# EAGLE design version_2 (EAGLE 6.1)

## Sheet 1 of 6
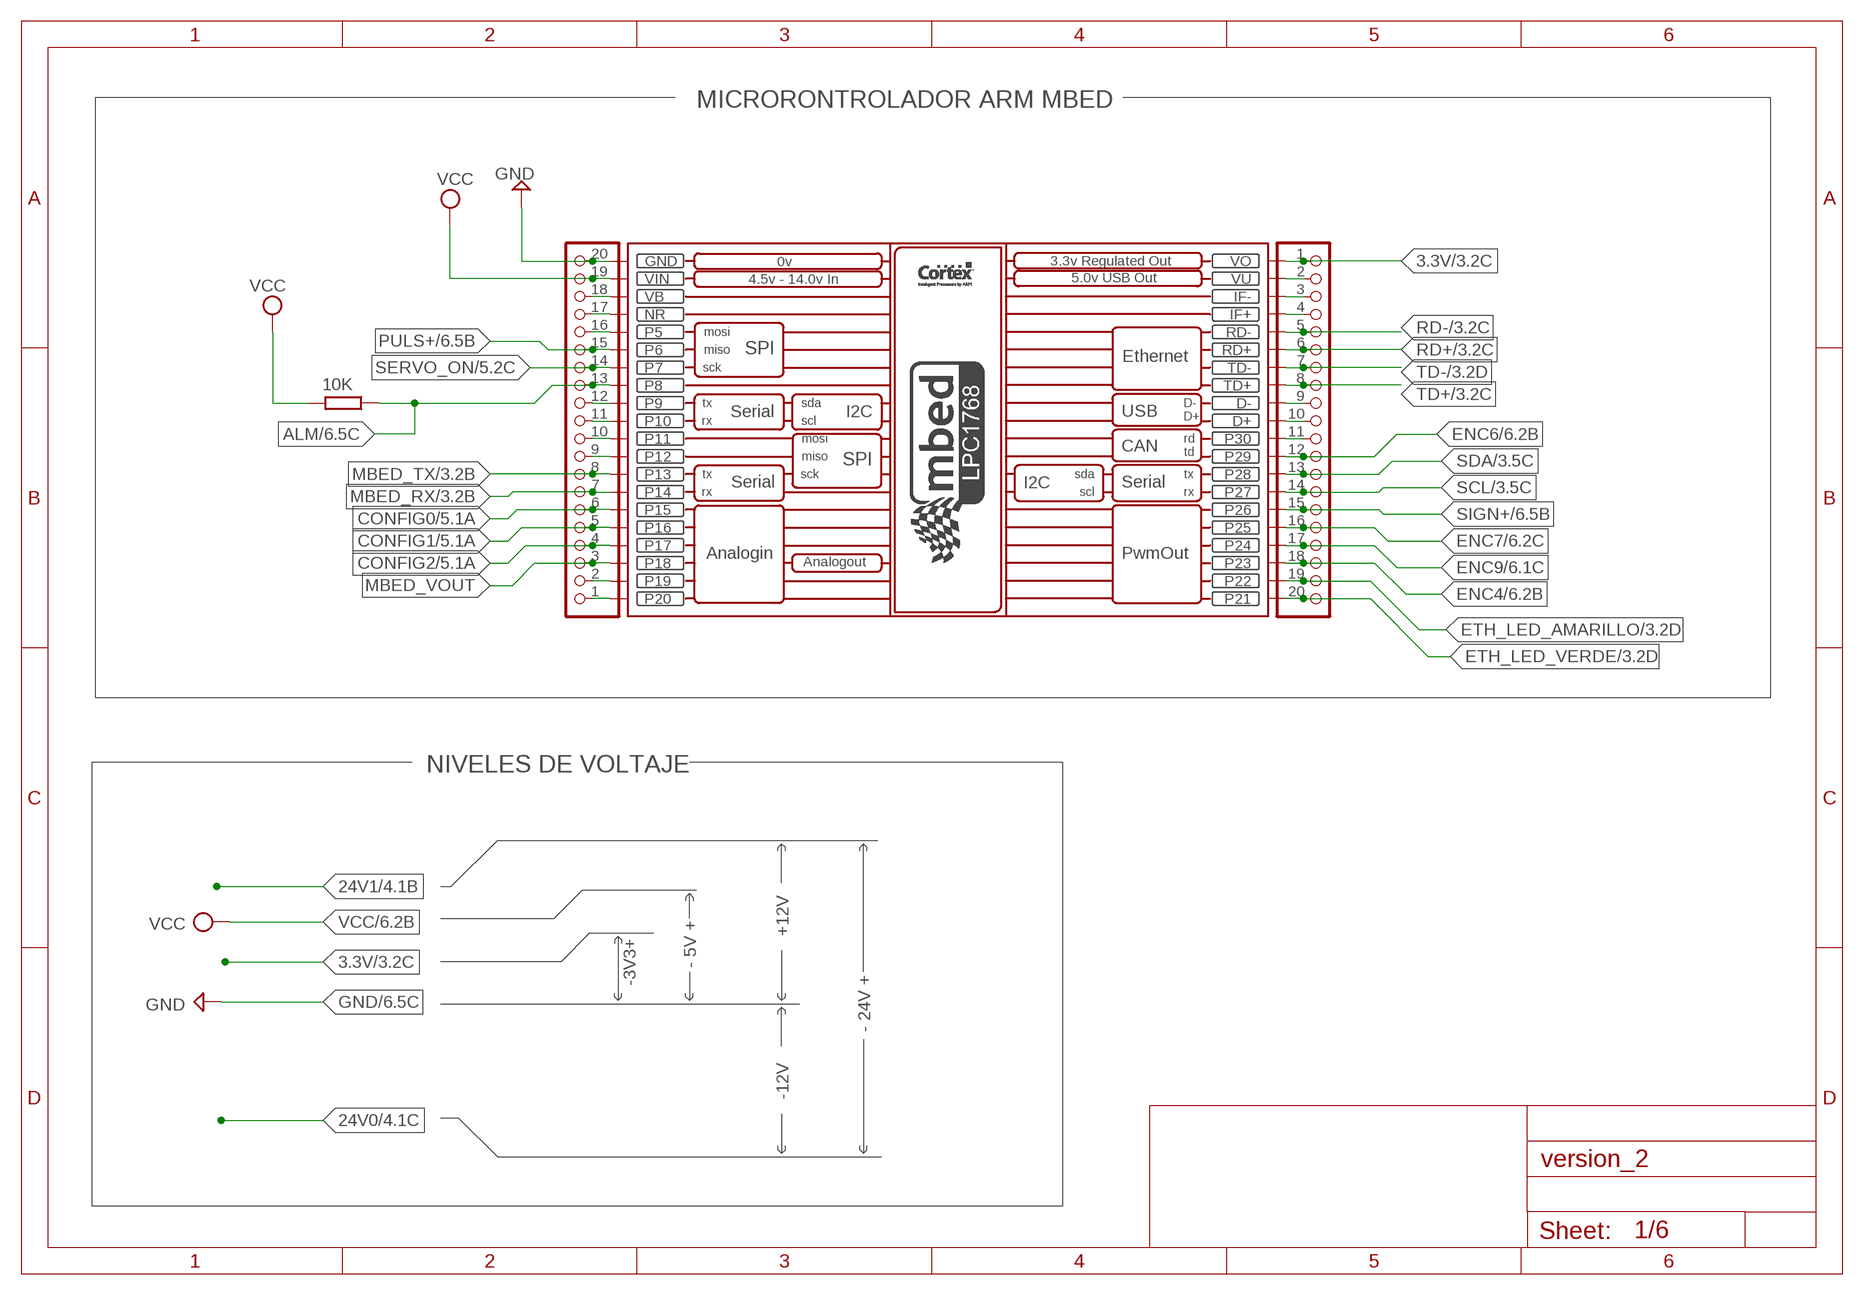
[diagram p0: schematic, sheet 1]

### Parts
JP_LEFT  PINHD-1X20  [1X20]
JP_RIGHT  PINHD-1X20  [1X20]
KIT1  MBED_NXP_LPC1768  [MBED-KIT]
R16_ALM  10K  R-EU_0207/12  [0207/12]

### Nets
3.3V: JP_RIGHT.1 KIT1.VOUT(VO) ; also sheet 3
ALM: JP_LEFT.13 KIT1.P$8(P8) R16_ALM.1 ; also sheet 6
CONFIG0: JP_LEFT.6 KIT1.P$15(P15) ; also sheet 5
CONFIG1: JP_LEFT.5 KIT1.P$16(P16) ; also sheet 5
CONFIG2: JP_LEFT.4 KIT1.P$17(P17) ; also sheet 5
ENC4: JP_RIGHT.18 KIT1.P$23(P23) ; also sheet 6
ENC6: JP_RIGHT.12 KIT1.P$29(P29) ; also sheet 6
ENC7: JP_RIGHT.16 KIT1.P$25(P25) ; also sheet 6
ENC9: JP_RIGHT.17 KIT1.P$24(P24) ; also sheet 6
ETH_LED_AMARILLO: JP_RIGHT.19 KIT1.P$22(P22) ; also sheet 3
ETH_LED_VERDE: JP_RIGHT.20 KIT1.P$21(P21) ; also sheet 3
GND: JP_LEFT.20 KIT1.GND ; also sheet 2,3,4,5,6
MBED_RX: JP_LEFT.7 KIT1.P$14(P14) ; also sheet 3
MBED_TX: JP_LEFT.8 KIT1.P$13(P13) ; also sheet 3
MBED_VOUT: JP_LEFT.3 KIT1.P$18(P18) ; also sheet 4
N$4: JP_LEFT.12 KIT1.P$9(P9)
N$5: JP_RIGHT.2 KIT1.VU
N$6: JP_LEFT.11 KIT1.P$10(P10)
N$7: JP_RIGHT.3 KIT1.IF-
N$14: JP_RIGHT.4 KIT1.IF+
N$16: JP_RIGHT.11 KIT1.P$30(P30)
N$31: JP_RIGHT.9 KIT1.D-
N$32: JP_RIGHT.10 KIT1.D+
N$48: JP_LEFT.18 KIT1.VB
N$49: JP_LEFT.17 KIT1.NR
N$50: JP_LEFT.16 KIT1.P$5(P5)
N$53: JP_LEFT.10 KIT1.P$11(P11)
N$54: JP_LEFT.9 KIT1.P$12(P12)
N$59: JP_LEFT.2 KIT1.P$19(P19)
N$60: JP_LEFT.1 KIT1.P$20(P20)
PULS+: JP_LEFT.15 KIT1.P$6(P6) ; also sheet 6
RD+: JP_RIGHT.6 KIT1.RD+ ; also sheet 3,6
RD-: JP_RIGHT.5 KIT1.RD- ; also sheet 3,6
SCL: JP_RIGHT.14 KIT1.P$27(P27) ; also sheet 3,6
SDA: JP_RIGHT.13 KIT1.P$28(P28) ; also sheet 3,6
SERVO_ON: JP_LEFT.14 KIT1.P$7(P7) ; also sheet 5
SIGN+: JP_RIGHT.15 KIT1.P$26(P26) ; also sheet 6
TD+: JP_RIGHT.8 KIT1.TD+ ; also sheet 3,6
TD-: JP_RIGHT.7 KIT1.TD- ; also sheet 3,6
VCC: JP_LEFT.19 KIT1.VIN R16_ALM.2 ; also sheet 2,3,5,6

### Notes on the sheet
- MICRORONTROLADOR ARM MBED
- NIVELES DE VOLTAJE
- +12V
- - 5V +
- -3V3+
- - 24V +
- -12V

## Sheet 2 of 6
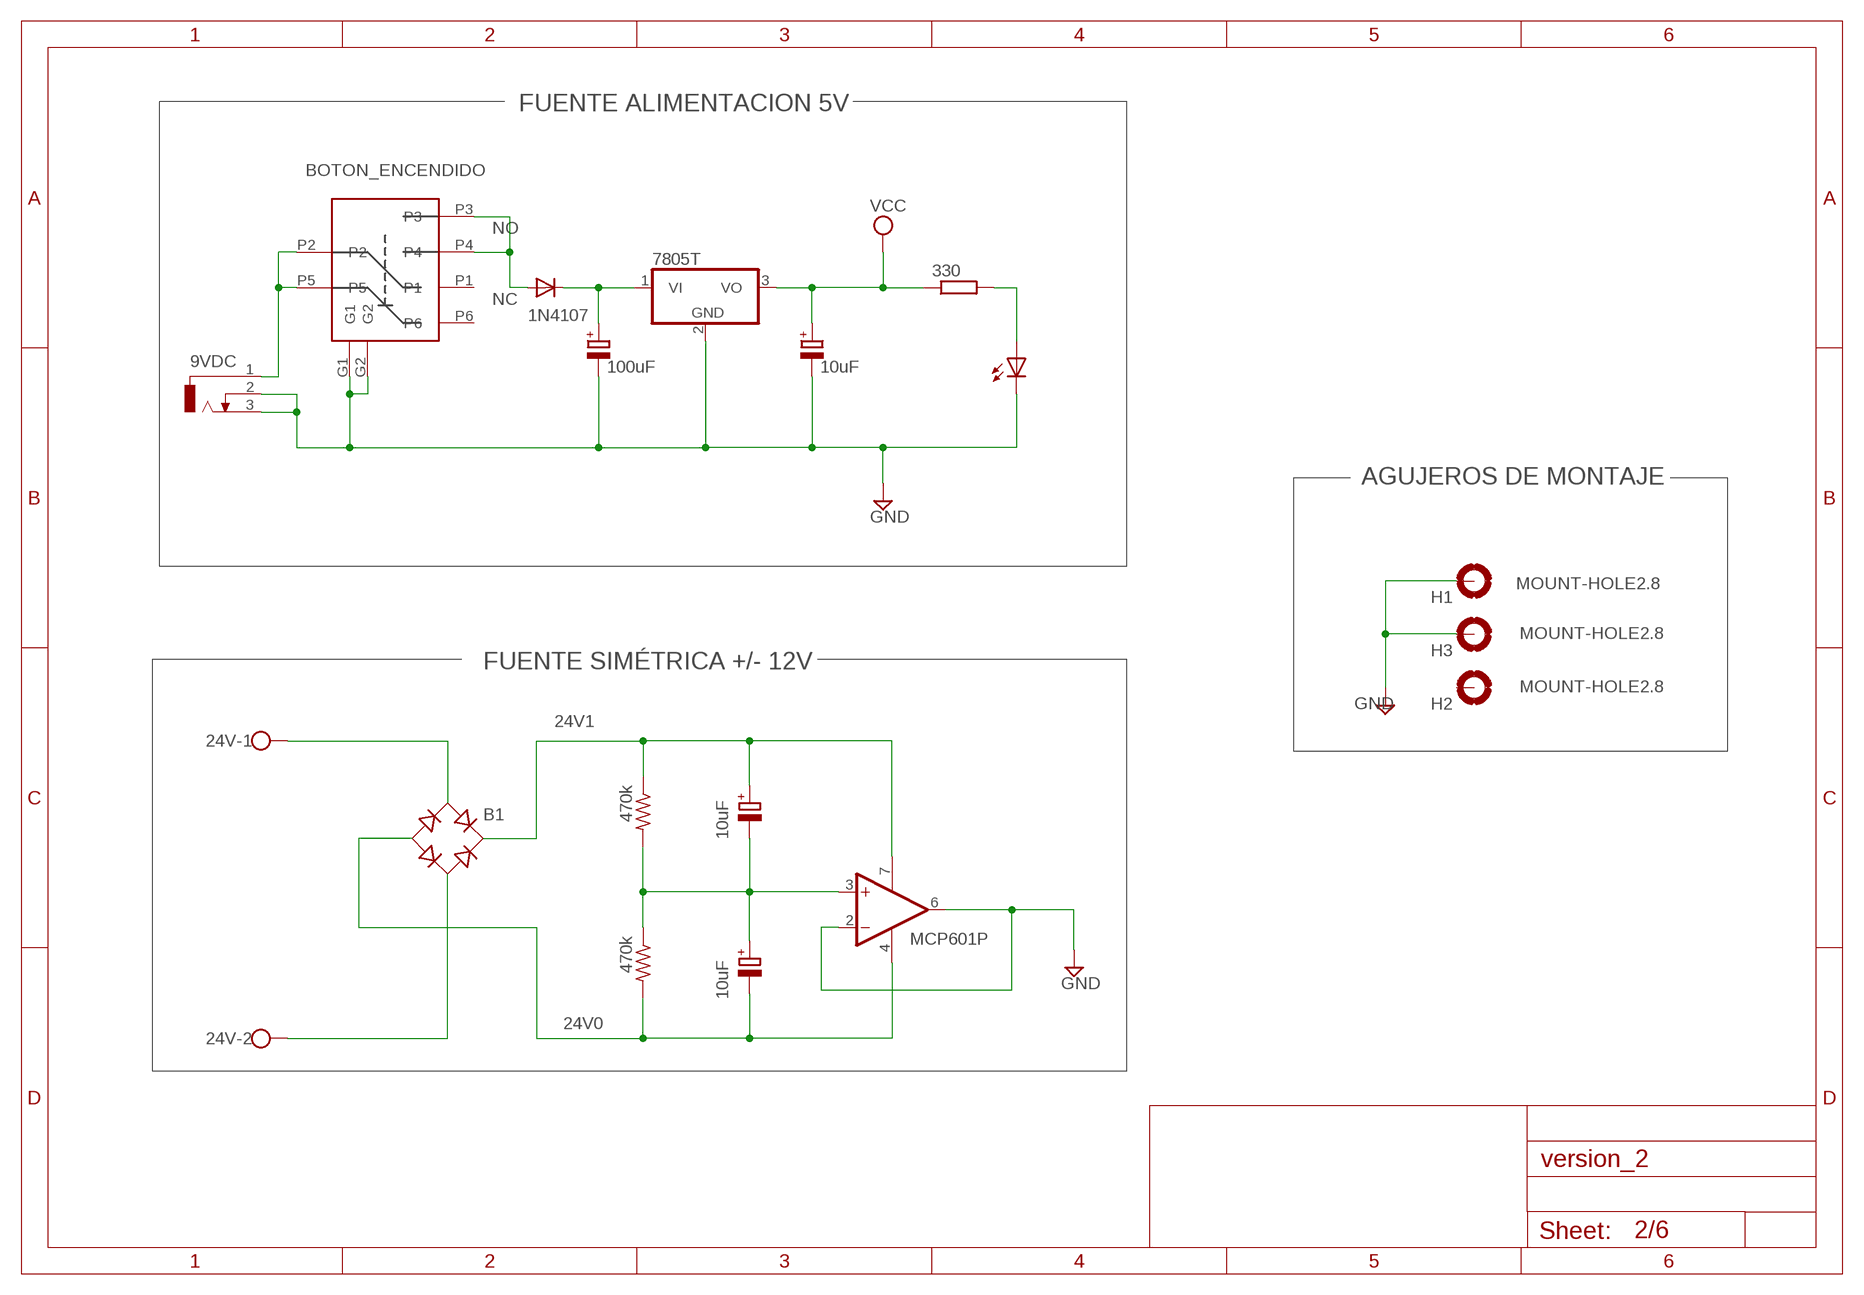
[diagram p1: schematic, sheet 2]

### Parts
9VDC  DCJ0303  [DCJ0303]
24V  W237-02P  [W237-132]
B1  RB1A  [RB1A]
C1_9V  100uF  CPOL-EUTT5D7  [TT5D7]
C1_+24  10uF  CPOL-EUTT5D7  [TT5D7]
C2_0V  10uF  CPOL-EUTT5D7  [TT5D7]
C2_9V  10uF  CPOL-EUTT5D7  [TT5D7]
D1_INPUT  1N4107  1N4148DO35-10  [DO35-10]
H1  MOUNT-HOLE2.8  MOUNT-PAD-ROUND3.3  [3,3-PAD]
H2  MOUNT-HOLE2.8  MOUNT-PAD-ROUND3.3  [3,3-PAD]
H3  MOUNT-HOLE2.8  MOUNT-PAD-ROUND3.3  [3,3-PAD]
IC2  7805T  [TO220H]
IC3  MCP601P  [DIL08]
ON/OFF  BOTON_ENCENDIDO  [BOTON_ENCNEDIDO]
POWER  LED3MM  [LED3MM]
PWR_LED_R  330  R-EU_0204/7  [0204/7]
R1_DIV  470k  R-US_0207/10  [0207/10]
R2_DIV  470k  R-US_0207/10  [0207/10]

### Nets
24V0: B1.- C2_0V.- IC3.4(V-) R2_DIV.2 ; also sheet 1,4,5,6
24V1: B1.+ C1_+24.+ IC3.7(V+) R1_DIV.1 ; also sheet 1,4,6
GND: 9VDC.2 9VDC.3 C1_9V.- C2_9V.- H1.B3,3(MOUNT) H3.B3,3(MOUNT) IC2.2(GND) IC3.2(-IN) IC3.6(OUT) ON/OFF.G1 ON/OFF.G2 POWER.K(C) ; also sheet 1,3,4,5,6
N$1: 24V.1 B1.AC1
N$2: 24V.2 B1.AC2
N$3: C1_+24.- C2_0V.+ IC3.3(+IN) R1_DIV.2 R2_DIV.1
N$12: D1_INPUT.A ON/OFF.P3 ON/OFF.P4
N$18: 9VDC.1 ON/OFF.P2 ON/OFF.P5
N$21: C1_9V.+ D1_INPUT.C IC2.1(VI)
N$61: POWER.A PWR_LED_R.2
VCC: C2_9V.+ IC2.3(VO) PWR_LED_R.1 ; also sheet 1,3,5,6
Unconnected: H2.B3,3(MOUNT) ON/OFF.P1 ON/OFF.P6

### Notes on the sheet
- FUENTE ALIMENTACION 5V
- AGUJEROS DE MONTAJE
- FUENTE SIMÉTRICA +/- 12V

## Sheet 3 of 6
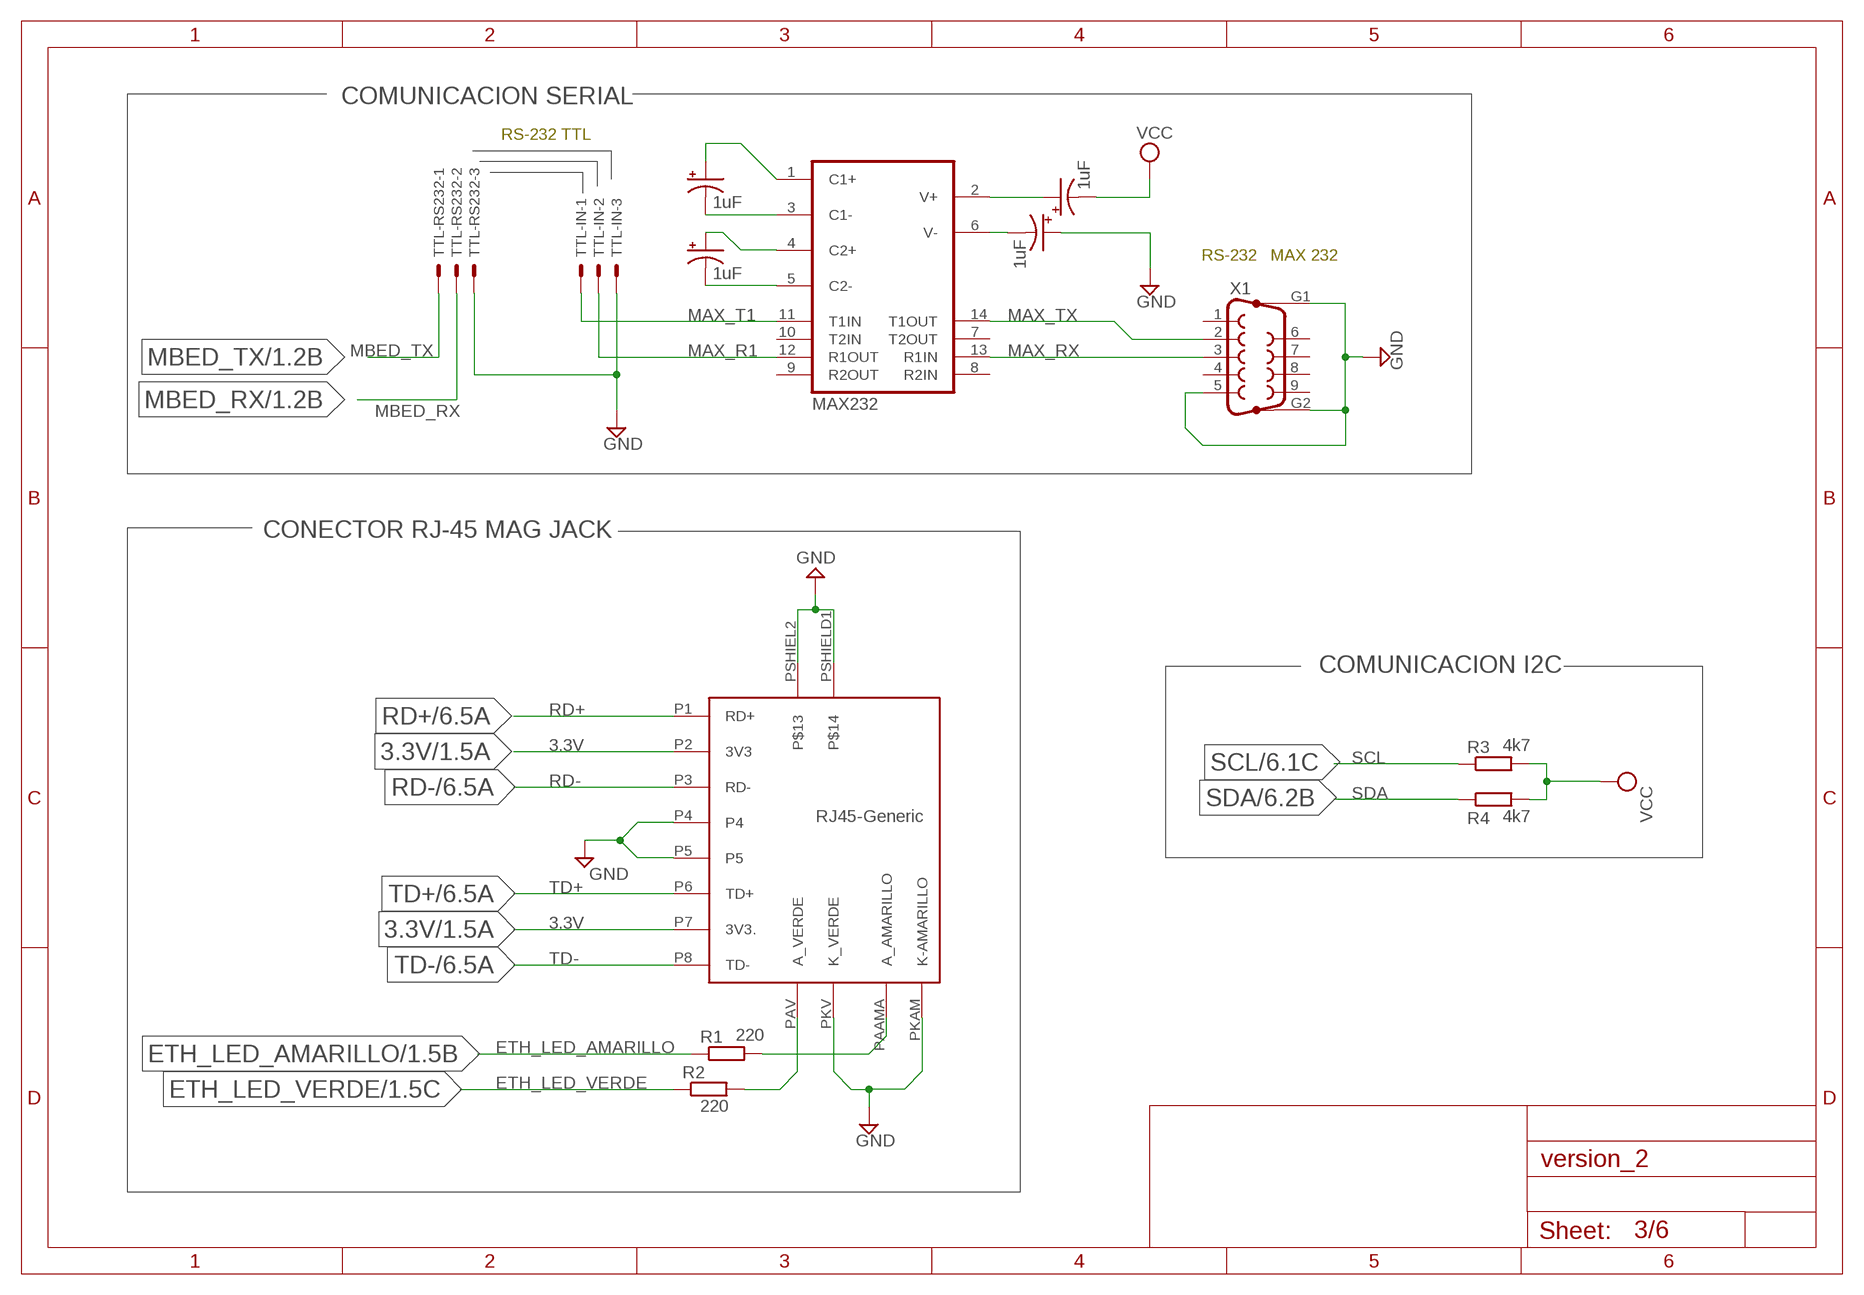
[diagram p2: schematic, sheet 3]

### Parts
C1_MAX  1uF  CPOL-USE2,5-6E  [E2,5-6E]
C2_MAX  1uF  CPOL-USE2,5-6E  [E2,5-6E]
C3_MAX  1uF  CPOL-USE2,5-6E  [E2,5-6E]
C4_MAX  1uF  CPOL-USE2,5-6E  [E2,5-6E]
IC1  MAX232  [DIL16]
R1  220  R-EU_0207/15  [0207/15]
R2  220  R-EU_0207/15  [0207/15]
R3  4k7  R-EU_0204/7  [0204/7]
R4  4k7  R-EU_0204/7  [0204/7]
TTL-IN  22-23-2031  [22-23-2031]
TTL-RS232  22-23-2031  [22-23-2031]
U$1  RJ-45-GENERIC  [RJ45-GENERIC]
X1  F09HP  [F09HP]

### Nets
3.3V: U$1.P2(3V3) U$1.P7(3V3.) ; also sheet 1
ETH_LED_AMARILLO: R1.1 ; also sheet 1
ETH_LED_VERDE: R2.1 ; also sheet 1
GND: C3_MAX.+ TTL-IN.3 TTL-RS232.3 U$1.P4 U$1.P5 U$1.PKAM(K-AMARILLO) U$1.PKV(K_VERDE) U$1.PSHIEL2 U$1.PSHIELD1 X1.5 X1.G1 X1.G2 ; also sheet 1,2,4,5,6
MAX_R1: IC1.12(R1OUT) TTL-IN.2
MAX_RX: IC1.13(R1IN) X1.3 ; also sheet 6
MAX_T1: IC1.11(T1IN) TTL-IN.1
MAX_TX: IC1.14(T1OUT) X1.2 ; also sheet 6
MBED_RX: TTL-RS232.2 ; also sheet 1
MBED_TX: TTL-RS232.1 ; also sheet 1
N$33: C1_MAX.+ IC1.1(C1+)
N$34: C1_MAX.- IC1.3(C1-)
N$35: C2_MAX.- IC1.5(C2-)
N$36: C2_MAX.+ IC1.4(C2+)
N$37: C4_MAX.+ IC1.2(V+)
N$38: C3_MAX.- IC1.6(V-)
N$46: R1.2 U$1.PAAMA(A_AMARILLO)
N$52: R2.2 U$1.PAV(A_VERDE)
RD+: U$1.P1(RD+) ; also sheet 1,6
RD-: U$1.P3(RD-) ; also sheet 1,6
SCL: R3.1 ; also sheet 1,6
SDA: R4.1 ; also sheet 1,6
TD+: U$1.P6(TD+) ; also sheet 1,6
TD-: U$1.P8(TD-) ; also sheet 1,6
VCC: C4_MAX.- R3.2 R4.2 ; also sheet 1,2,5,6
Unconnected: IC1.7(T2OUT) IC1.8(R2IN) IC1.9(R2OUT) IC1.10(T2IN) X1.1 X1.4 X1.6 X1.7 X1.8 X1.9

### Notes on the sheet
- COMUNICACION SERIAL
- RS-232 TTL
- RS-232   MAX 232
- CONECTOR RJ-45 MAG JACK
- COMUNICACION I2C

## Sheet 4 of 6
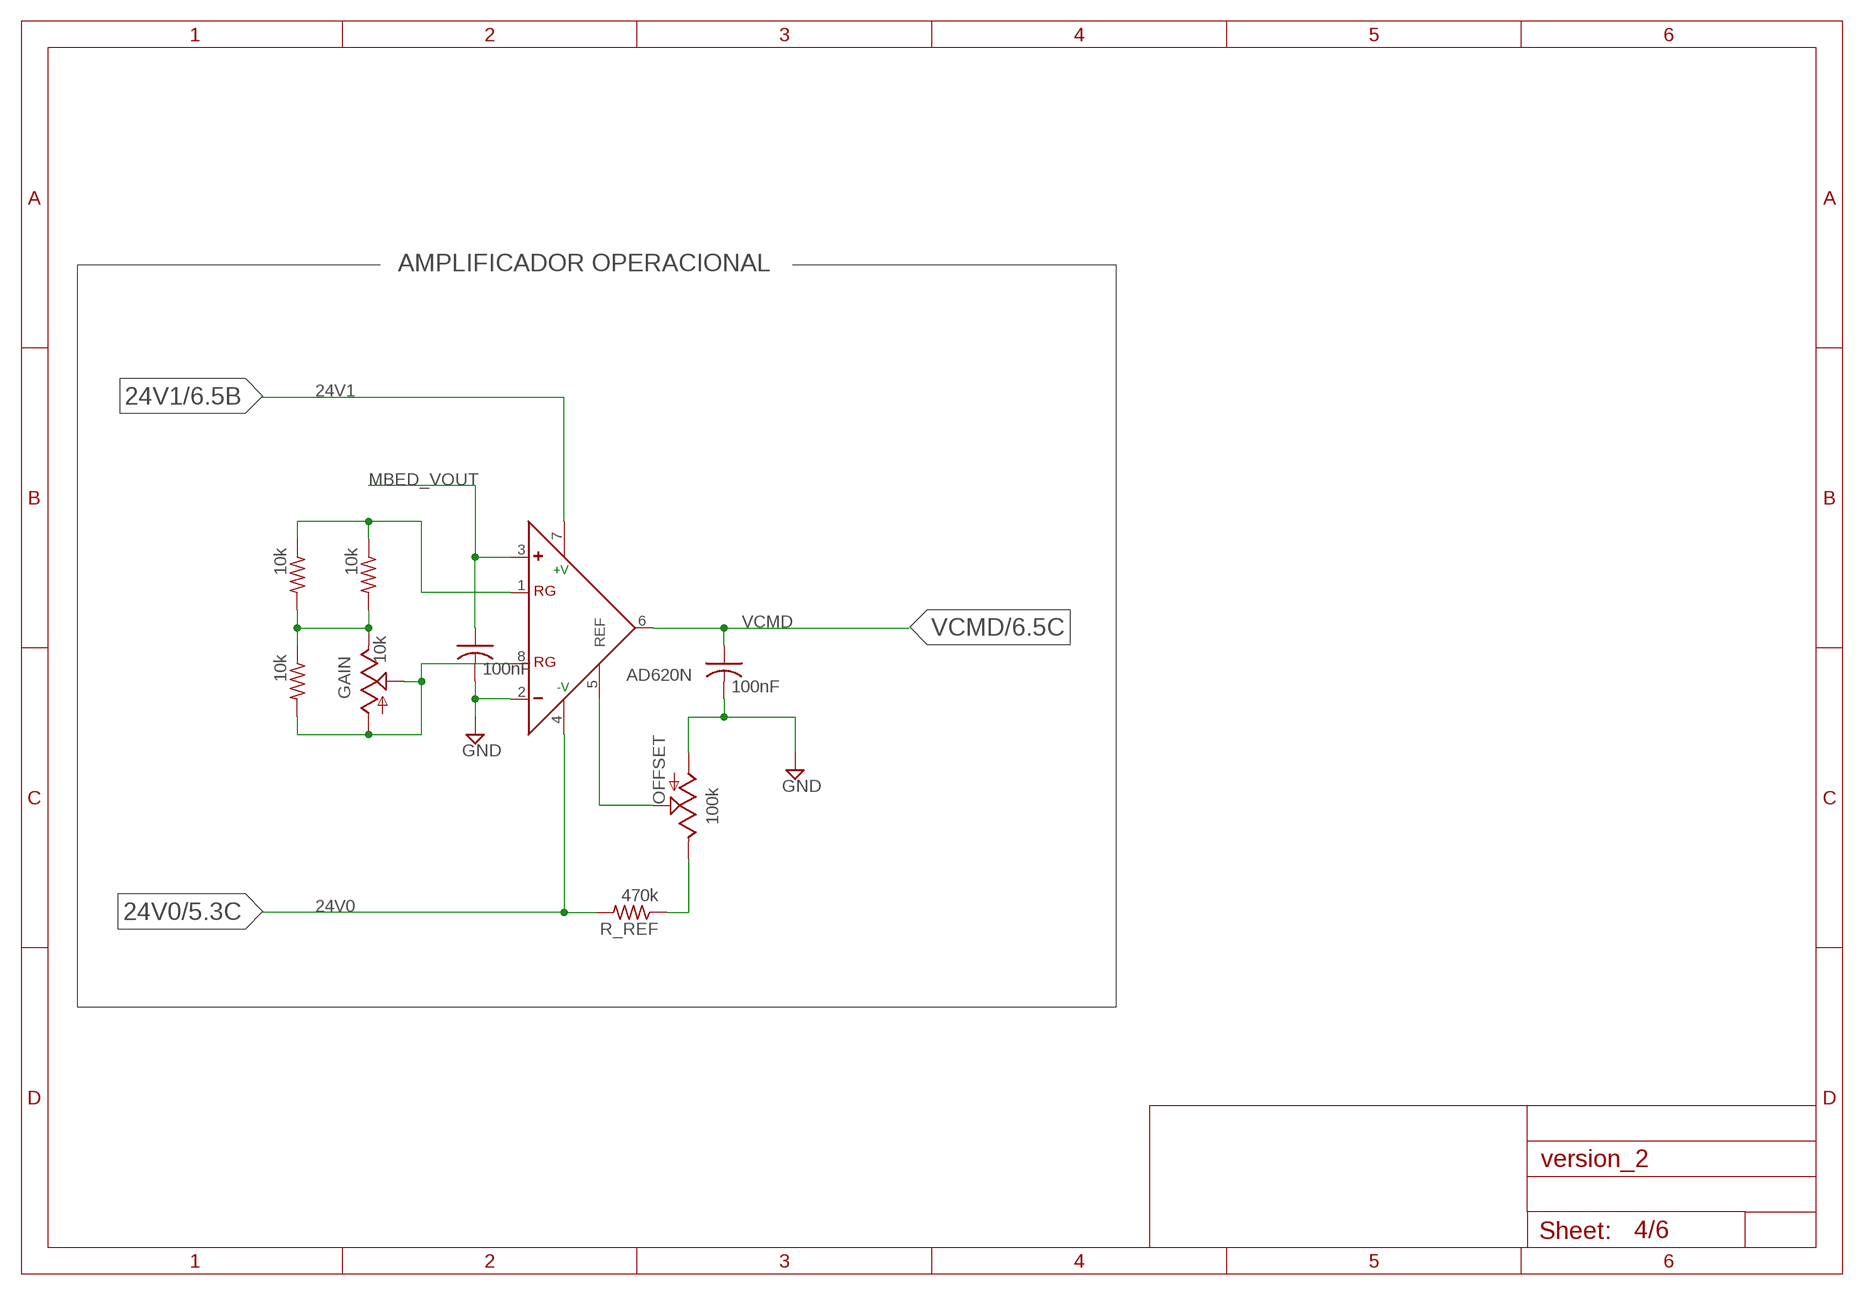
[diagram p3: schematic, sheet 4]

### Parts
C3_AOUT  100nF  C-US025-024X044  [C025-024X044]
C5_AOUT  100nF  C-US025-024X044  [C025-024X044]
GAIN  10k  TRIM_US-RJ9W  [RJ9W]
IC4  AD620N  [DIL08]
OFFSET  100k  TRIM_US-RJ9W  [RJ9W]
R1_G  10k  R-US_0204/7  [0204/7]
R2_G  10k  R-US_0204/7  [0204/7]
R3_G  10k  R-US_0204/7  [0204/7]
R_REF  470k  R-US_0204/7  [0204/7]

### Nets
24V0: IC4.4(-V) R_REF.2 ; also sheet 1,2,5,6
24V1: IC4.7(+V) ; also sheet 1,2,6
GND: C3_AOUT.2 C5_AOUT.2 IC4.2(-) OFFSET.A ; also sheet 1,2,3,5,6
MBED_VOUT: C5_AOUT.1 IC4.3(+) ; also sheet 1
N$8: OFFSET.E R_REF.1
N$9: IC4.1(RG) R1_G.1 R3_G.1
N$10: GAIN.E R1_G.2 R2_G.1 R3_G.2
N$11: GAIN.A GAIN.S IC4.8(RG) R2_G.2
N$15: IC4.5(REF) OFFSET.S
VCMD: C3_AOUT.1 IC4.6(OUT) ; also sheet 6

### Notes on the sheet
- AMPLIFICADOR OPERACIONAL

## Sheet 5 of 6
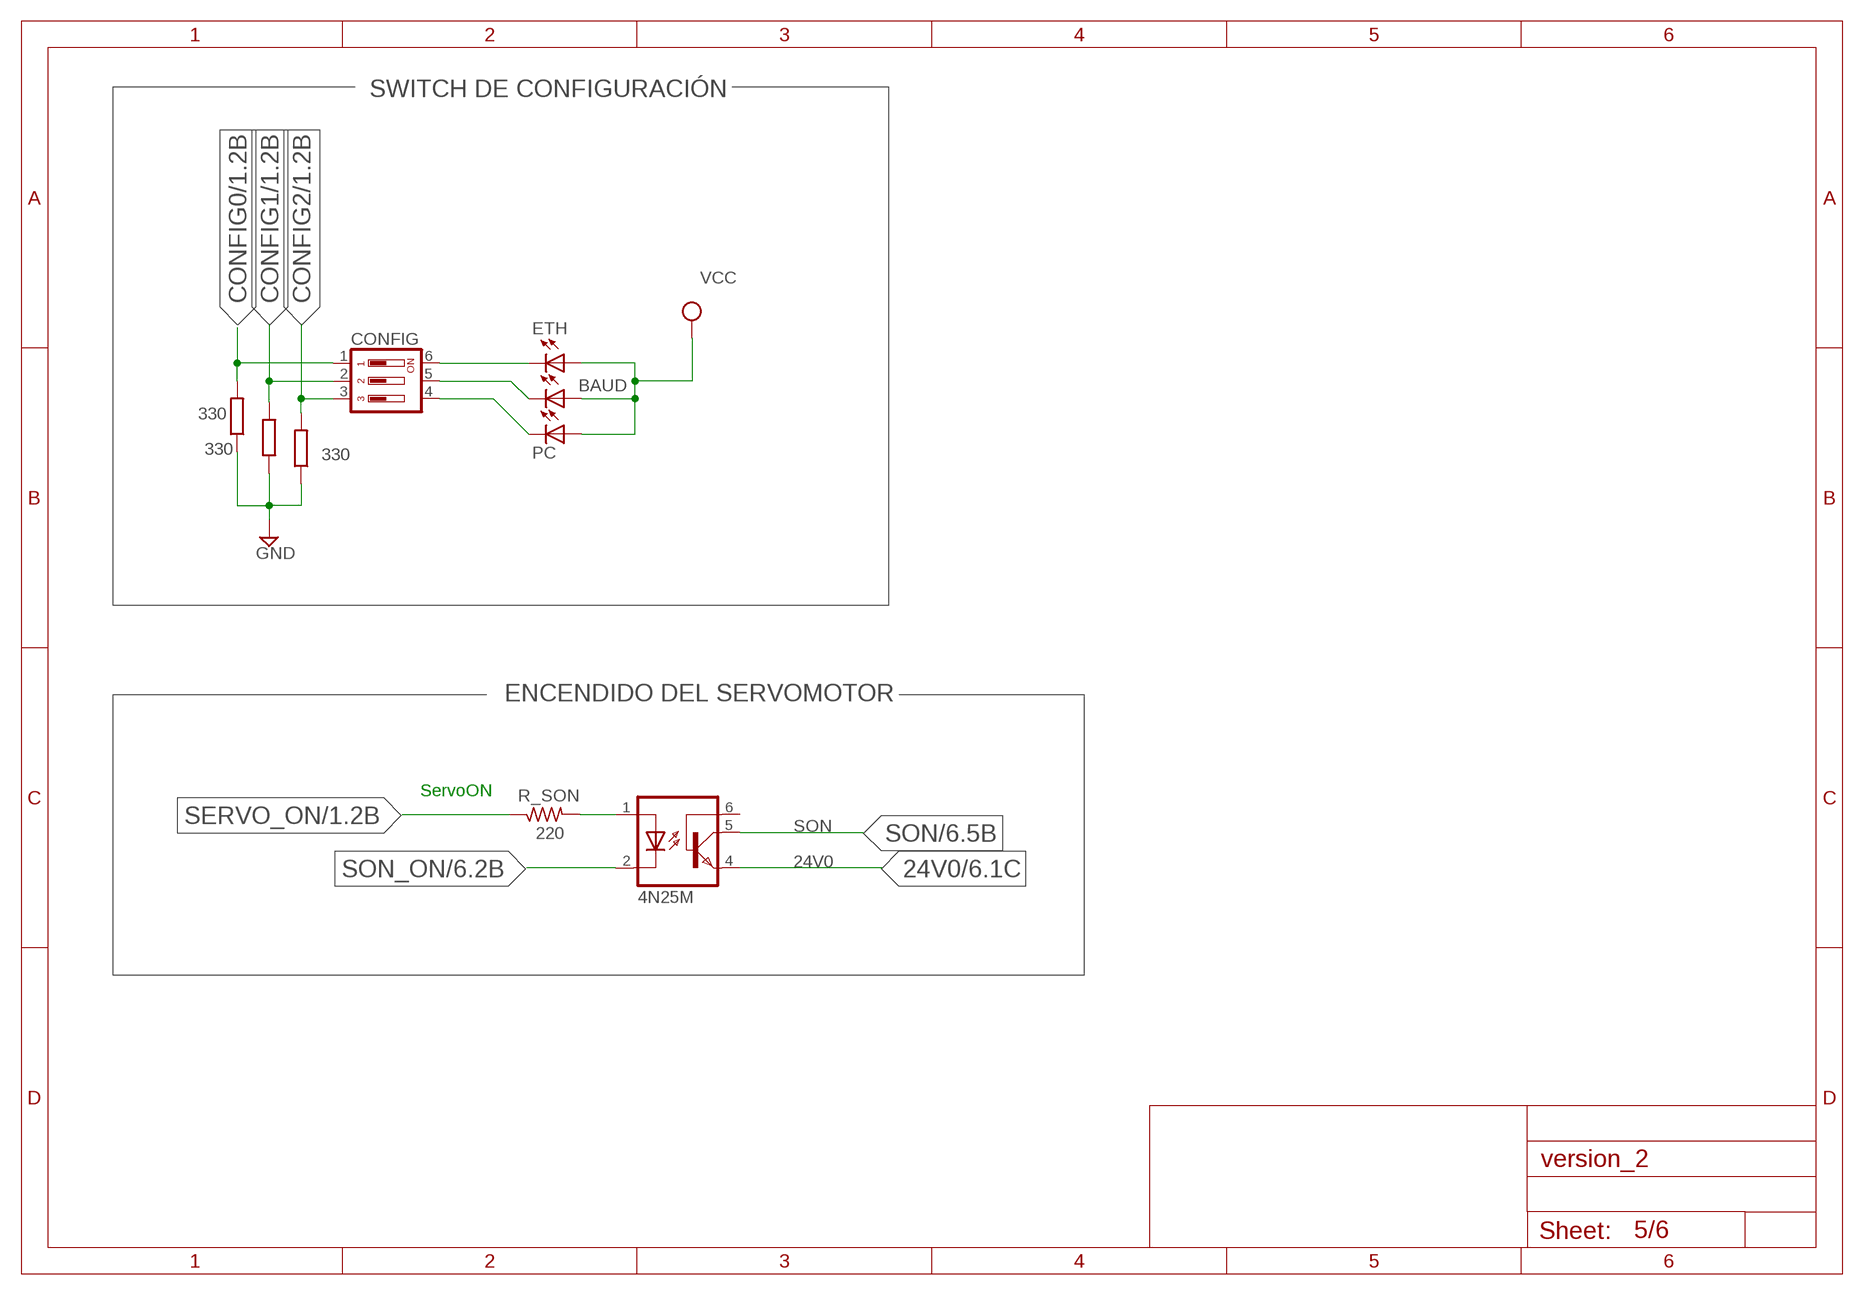
[diagram p4: schematic, sheet 5]

### Parts
BAUD  LED3MM  [LED3MM]
CONFIG  DIP03YL  [DIP03YL]
ETH  LED3MM  [LED3MM]
OK1  4N25M  [DIL06]
PC  LED3MM  [LED3MM]
R13  330  R-EU_0204/7  [0204/7]
R14  330  R-EU_0204/7  [0204/7]
R15  330  R-EU_0204/7  [0204/7]
R_SON  220  R-US_0207/7  [0207/7]

### Nets
24V0: OK1.4(EMI) ; also sheet 1,2,4,6
CONFIG0: CONFIG.1 R15.2 ; also sheet 1
CONFIG1: CONFIG.2 R14.2 ; also sheet 1
CONFIG2: CONFIG.3 R13.2 ; also sheet 1
GND: R13.1 R14.1 R15.1 ; also sheet 1,2,3,4,6
N$20: OK1.1(A) R_SON.2
N$24: CONFIG.6 ETH.K(C)
N$25: BAUD.K(C) CONFIG.5
N$26: CONFIG.4 PC.K(C)
SERVO_ON: R_SON.1 ; also sheet 1
SON: OK1.5(COL) ; also sheet 6
SON_ON: OK1.2(C) ; also sheet 6
VCC: BAUD.A ETH.A PC.A ; also sheet 1,2,3,6
Unconnected: OK1.6(BAS)

### Notes on the sheet
- SWITCH DE CONFIGURACIÓN
- ENCENDIDO DEL SERVOMOTOR
- ServoON

## Sheet 6 of 6
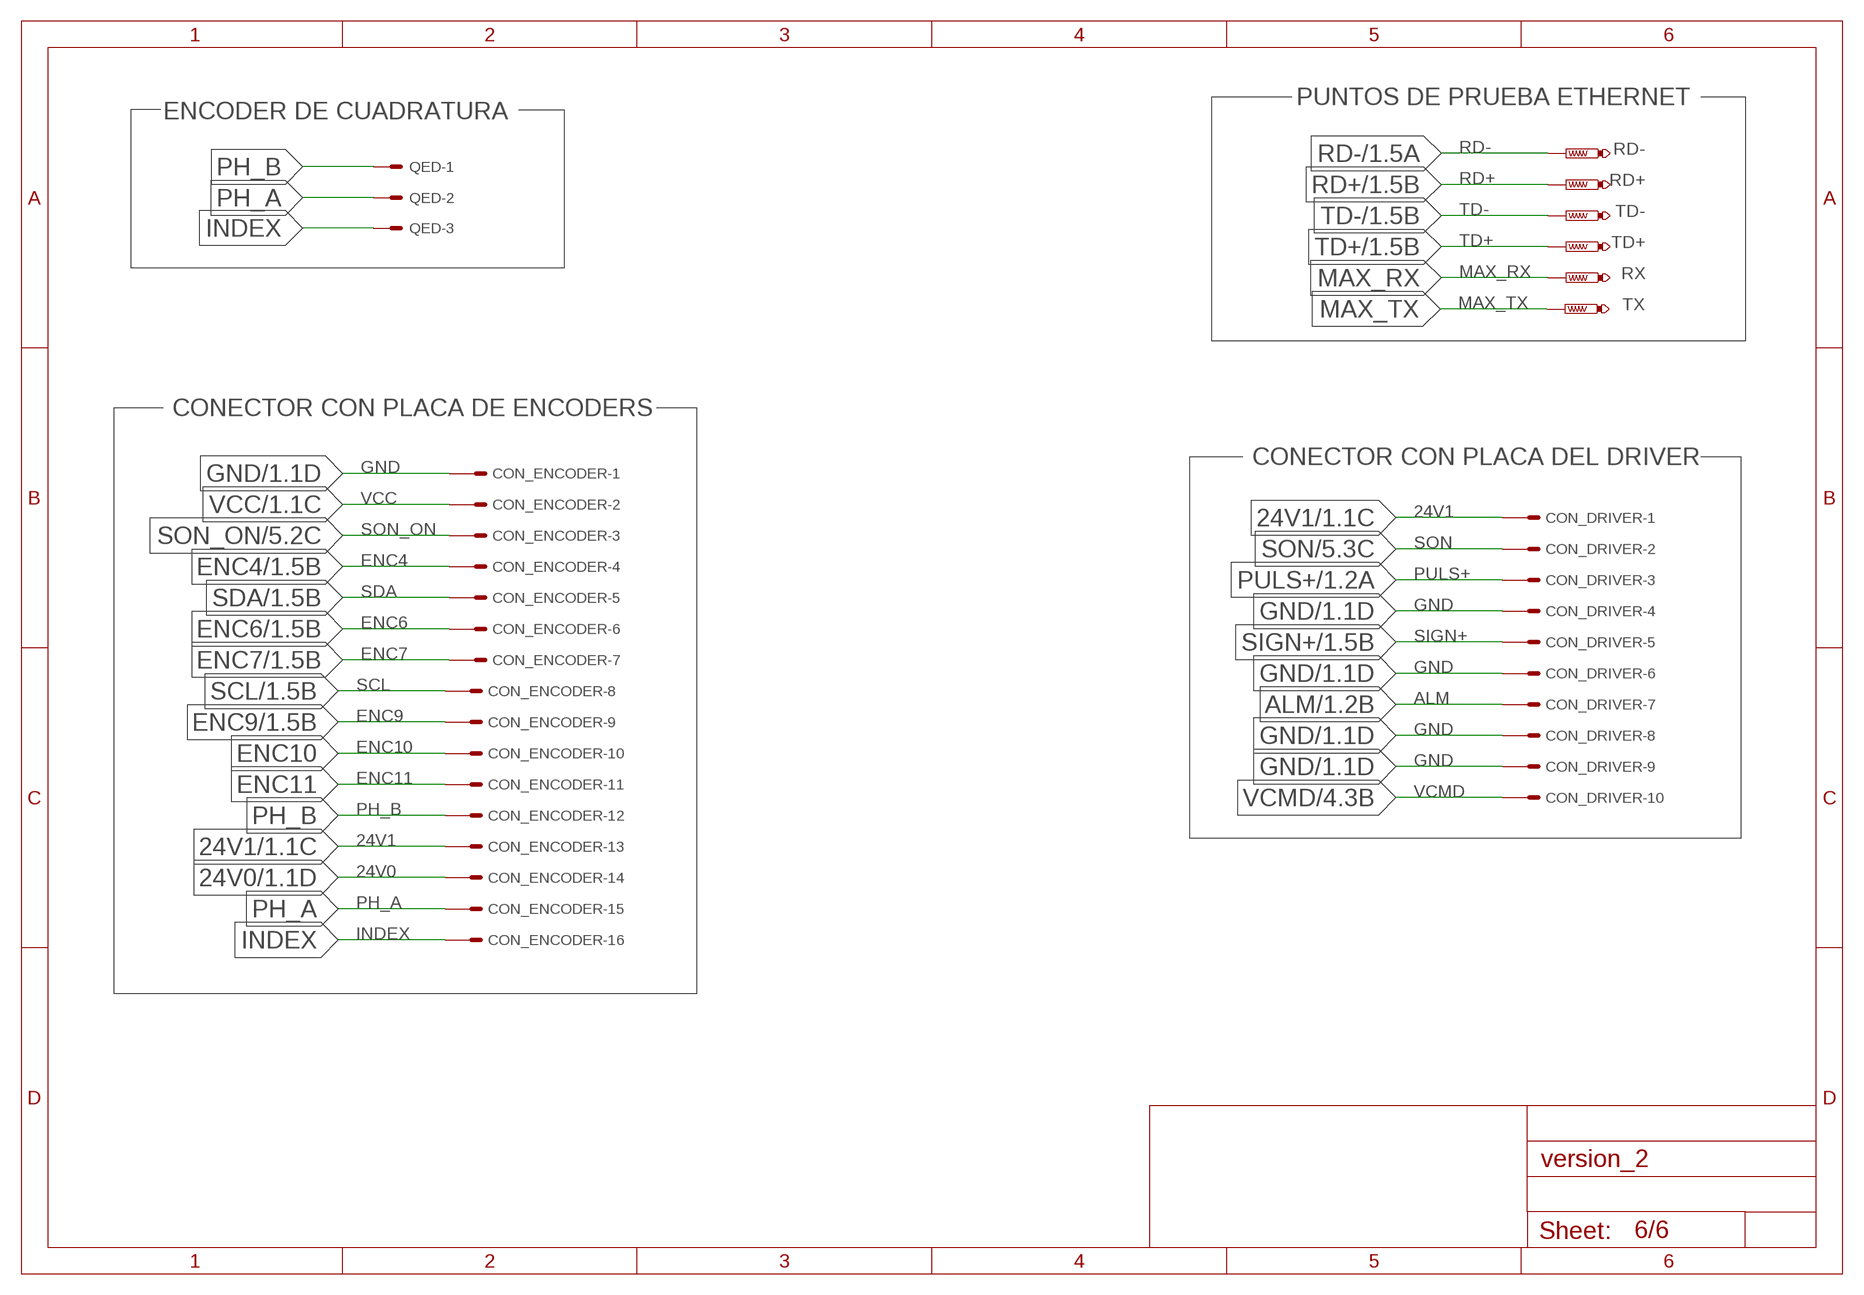
[diagram p5: schematic, sheet 6]

### Parts
CON_DRIVER  057-010-1  [057-010-1]
CON_ENCODER  057-016-1  [057-016-1]
QED  22-23-2031  [22-23-2031]
RD+  PTR1PAD1-13Y  [P1-13Y]
RD-  PTR1PAD1-13Y  [P1-13Y]
RX  PTR1PAD1-13Y  [P1-13Y]
TD+  PTR1PAD1-13Y  [P1-13Y]
TD-  PTR1PAD1-13Y  [P1-13Y]
TX  PTR1PAD1-13Y  [P1-13Y]

### Nets
24V0: CON_ENCODER.14 ; also sheet 1,2,4,5
24V1: CON_DRIVER.1 CON_ENCODER.13 ; also sheet 1,2,4
ALM: CON_DRIVER.7 ; also sheet 1
ENC4: CON_ENCODER.4 ; also sheet 1
ENC6: CON_ENCODER.6 ; also sheet 1
ENC7: CON_ENCODER.7 ; also sheet 1
ENC9: CON_ENCODER.9 ; also sheet 1
ENC10: CON_ENCODER.10
ENC11: CON_ENCODER.11
GND: CON_DRIVER.4 CON_DRIVER.6 CON_DRIVER.8 CON_DRIVER.9 CON_ENCODER.1 ; also sheet 1,2,3,4,5
INDEX: CON_ENCODER.16 QED.3
MAX_RX: RX.TP ; also sheet 3
MAX_TX: TX.TP ; also sheet 3
PH_A: CON_ENCODER.15 QED.2
PH_B: CON_ENCODER.12 QED.1
PULS+: CON_DRIVER.3 ; also sheet 1
RD+: RD+.TP ; also sheet 1,3
RD-: RD-.TP ; also sheet 1,3
SCL: CON_ENCODER.8 ; also sheet 1,3
SDA: CON_ENCODER.5 ; also sheet 1,3
SIGN+: CON_DRIVER.5 ; also sheet 1
SON: CON_DRIVER.2 ; also sheet 5
SON_ON: CON_ENCODER.3 ; also sheet 5
TD+: TD+.TP ; also sheet 1,3
TD-: TD-.TP ; also sheet 1,3
VCC: CON_ENCODER.2 ; also sheet 1,2,3,5
VCMD: CON_DRIVER.10 ; also sheet 4

### Notes on the sheet
- PUNTOS DE PRUEBA ETHERNET
- ENCODER DE CUADRATURA
- CONECTOR CON PLACA DE ENCODERS
- CONECTOR CON PLACA DEL DRIVER

## Power pins joined to a net without a drawn wire
GND: IC1.15(GND)
VCC: IC1.16(VCC)

## Library data of the parts
9VDC = con-jack:DCJ0303: DC POWER JACK Source: DCJ0303.pdf
24V = con-wago-508:W237-02P: WAGO SREW CLAMP
B1 = rectifier:RB1A: RECTIFIER 1 A
BAUD ETH PC POWER = led:LED: LED OSRAM: - CHIPLED LG R971, LG N971, LY N971, LG Q971, LY Q971, LO R971, LY R971 LH N974, LH R974 LS Q976, LO Q976, LY Q976 LO Q996 - Hyper CHIPLED LW Q18S LB Q993, LB Q99A, LB R99A - SideLED LS A670, LO A670, LY A670, LG A670, LP A670 LB A673, LV A673, LT A673, LW A673 LH A674 LY A675 LS A676, LA A676, LO A676, LY A676, LW A676 LS A679, LY A679, LG A679 - Hyper Micro SIDELED® LS Y876, LA Y876, LO Y876, LY Y876 LT Y87S - SmartLED LW L88C, LW L88S LB L89C, LB L89S, LG L890 LS L89K, LO L89K, LY L89K LS L896, LA L896, LO L896, LY L896 - TOPLED LS T670, LO T670, LY T670, LG T670, LP T670 LSG T670, LSP T670, LSY T670, LOP T670, LYG T670 LG T671, LOG T671, LSG T671 LB T673, LV T673, LT T673, LW T673 LH T674 LS T676, LA T676, LO T676, LY T676, LB T676, LH T676, LSB T676, LW T676 LB T67C, LV T67C, LT T67C, LS T67K, LO T67K, LY T67K, LW E67C LS E67B, LA E67B, LO E67B, LY E67B, LB E67C, LV E67C, LT E67C LW T67C LS T679, LY T679, LG T679 LS T770, LO T770, LY T770, LG T770, LP T770 LB T773, LV T773, LT T773, LW T773 LH T774 LS E675, LA E675, LY E675, LS T675 LS T776, LA T776, LO T776, LY T776, LB T776 LHGB T686 LT T68C, LB T68C - Hyper Mini TOPLED® LB M676 - Mini TOPLED Santana® LG M470 LS M47K, LO M47K, LY M47K Source: http://www.osram.convergy.de LUXEON: - LUMILED® LXK2-PW12-R00, LXK2-PW12-S00, LXK2-PW14-U00, LXK2-PW14-V00 LXK2-PM12-R00, LXK2-PM12-S00, LXK2-PM14-U00 LXK2-PE12-Q00, LXK2-PE12-R00, LXK2-PE12-S00, LXK2-PE14-T00, LXK2-PE14-U00 LXK2-PB12-K00, LXK2-PB12-L00, LXK2-PB12-M00, LXK2-PB14-N00, LXK2-PB14-P00, LXK2-PB14-Q00 LXK2-PR12-L00, LXK2-PR12-M00, LXK2-PR14-Q00, LXK2-PR14-R00 LXK2-PD12-Q00, LXK2-PD12-R00, LXK2-PD12-S00 LXK2-PH12-R00, LXK2-PH12-S00 LXK2-PL12-P00, LXK2-PL12-Q00, LXK2-PL12-R00 Source: www.luxeon.com KINGBRIGHT: KA-3528ASYC Source: www.kingbright.com
C1_9V C1_+24 C2_0V C2_9V = rcl:CPOL-EU: POLARIZED CAPACITOR, European symbol
C1_MAX C2_MAX C3_MAX C4_MAX = rcl:CPOL-US: POLARIZED CAPACITOR, American symbol
C3_AOUT C5_AOUT = rcl:C-US: CAPACITOR, American symbol
CON_DRIVER = con-panduit:057-010-: CONNECTOR 10-pin series 057 contact pc board low profile headers; OC_FARNELL: unknown; OC_NEWARK: unknown
CON_ENCODER = con-panduit:057-016-: CONNECTOR 10-pin series 057 contact pc board low profile headers; OC_FARNELL: unknown; OC_NEWARK: unknown
CONFIG = switch-dil:DIP03YL: DIL/CODE SWITCH
D1_INPUT = diode:1N4148: DIODE high speed (Philips)
GAIN OFFSET = pot:TRIM_US-: POTENTIOMETER
H1-H3 = holes:MOUNT-PAD-ROUND: MOUNTING PAD, round
IC1 = maxim:MAX232: RS232 TRANSEIVER
IC2 = linear:78*: Positive VOLTAGE REGULATOR Source: http://cache.national.com/ds/LM/LM78L05.pdf http://www.fairchildsemi.com/ds/LM/LM7805.pdf
IC3 = linear:MCP601: Single Op Amp 2.7V to 6.0V Single Supply CMOS Source: http://ww1.microchip.com/downloads/en/DeviceDoc/21314g.pdf
IC4 = analog-devices:AD620: Low Cost, Low Power, Instrumentation Amplifier Source: http://www.analog.com/UploadedFiles/Data_Sheets/37793330023930AD620_e.pdf
JP_LEFT JP_RIGHT = pinhead:PINHD-1X20: PIN HEADER
KIT1 = MBED_v2.1:MBED_NXP_LPC1768: Mbed LPC1768 - ARM CORTEX v2.1 * Schematic symbol is now placed in eagles's default raster. *The pads diameter are suitable for routing between mbed pins * mbed pads are 0.8 mm drill diameter. --------------------------------------------- Created by: Mohamed Yousry *Alexandria, Egypt *Email: mohamed.yousry@ieeegoldegypt.org
OK1 = optocoupler:4N*?M: General Purpose 6-Pin Phototransistor Optocouplers Source: http://www.fairchildsemi.com/ds/4N/4N35-M.pdf
ON/OFF = Boton_Encendido:BOTON_ENCENDIDO
PWR_LED_R R1-R4 R13-R15 R16_ALM = rcl:R-EU_: RESISTOR, European symbol
QED TTL-IN TTL-RS232 = con-molex:22-23-2031: .100" (2.54mm) Center Header - 3 Pin; MF: MOLEX; MPN: 22-23-2031; OC_FARNELL: 1462950; OC_NEWARK: 30C0862
R1_DIV R1_G R2_DIV R2_G R3_G R_REF = resistor:R-US_: RESISTOR, American symbol
R_SON = rcl:R-US_: RESISTOR, American symbol
RD+ RD- RX TD+ TD- TX = testpad:PTR1: TEST PIN
U$1 = RJ45:RJ-45-GENERIC
X1 = con-subd:F09HP: SUB-D

## Board
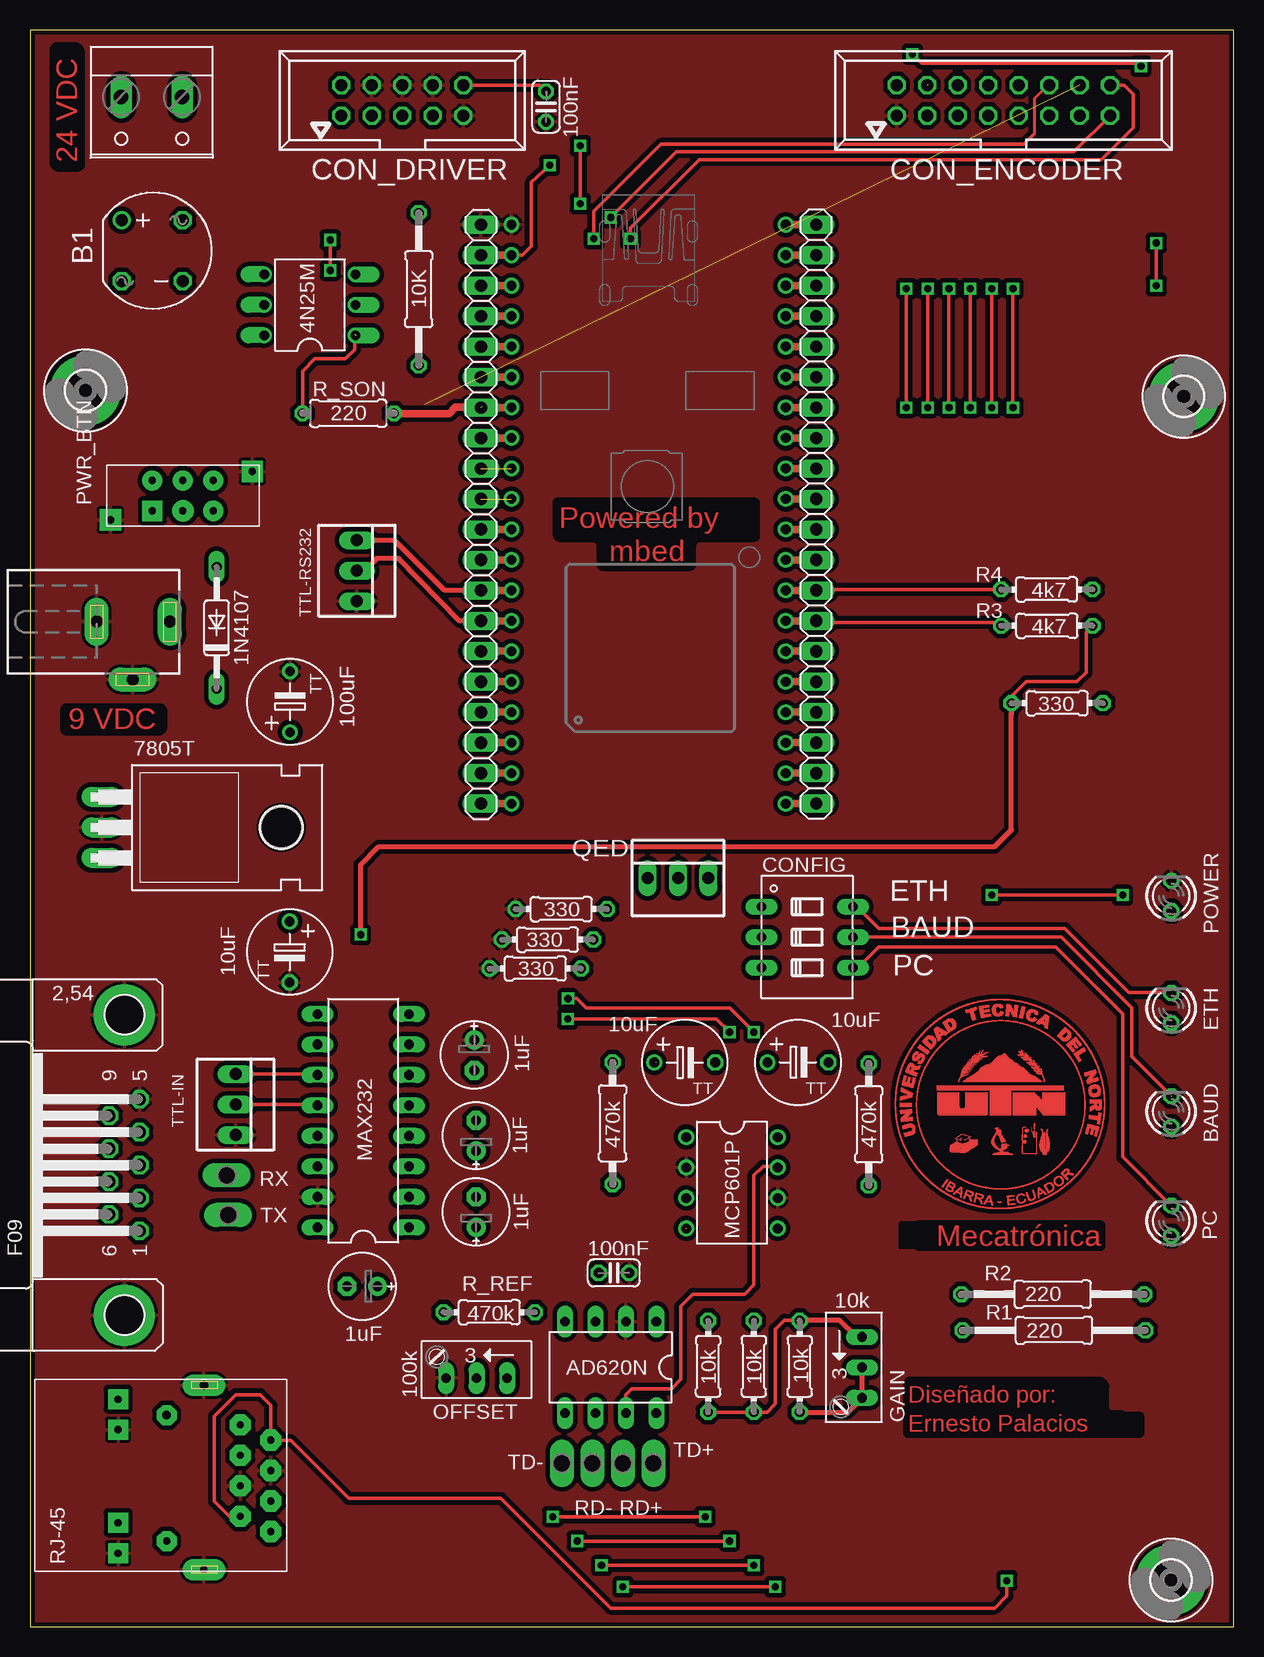
[diagram p6: board, top side]
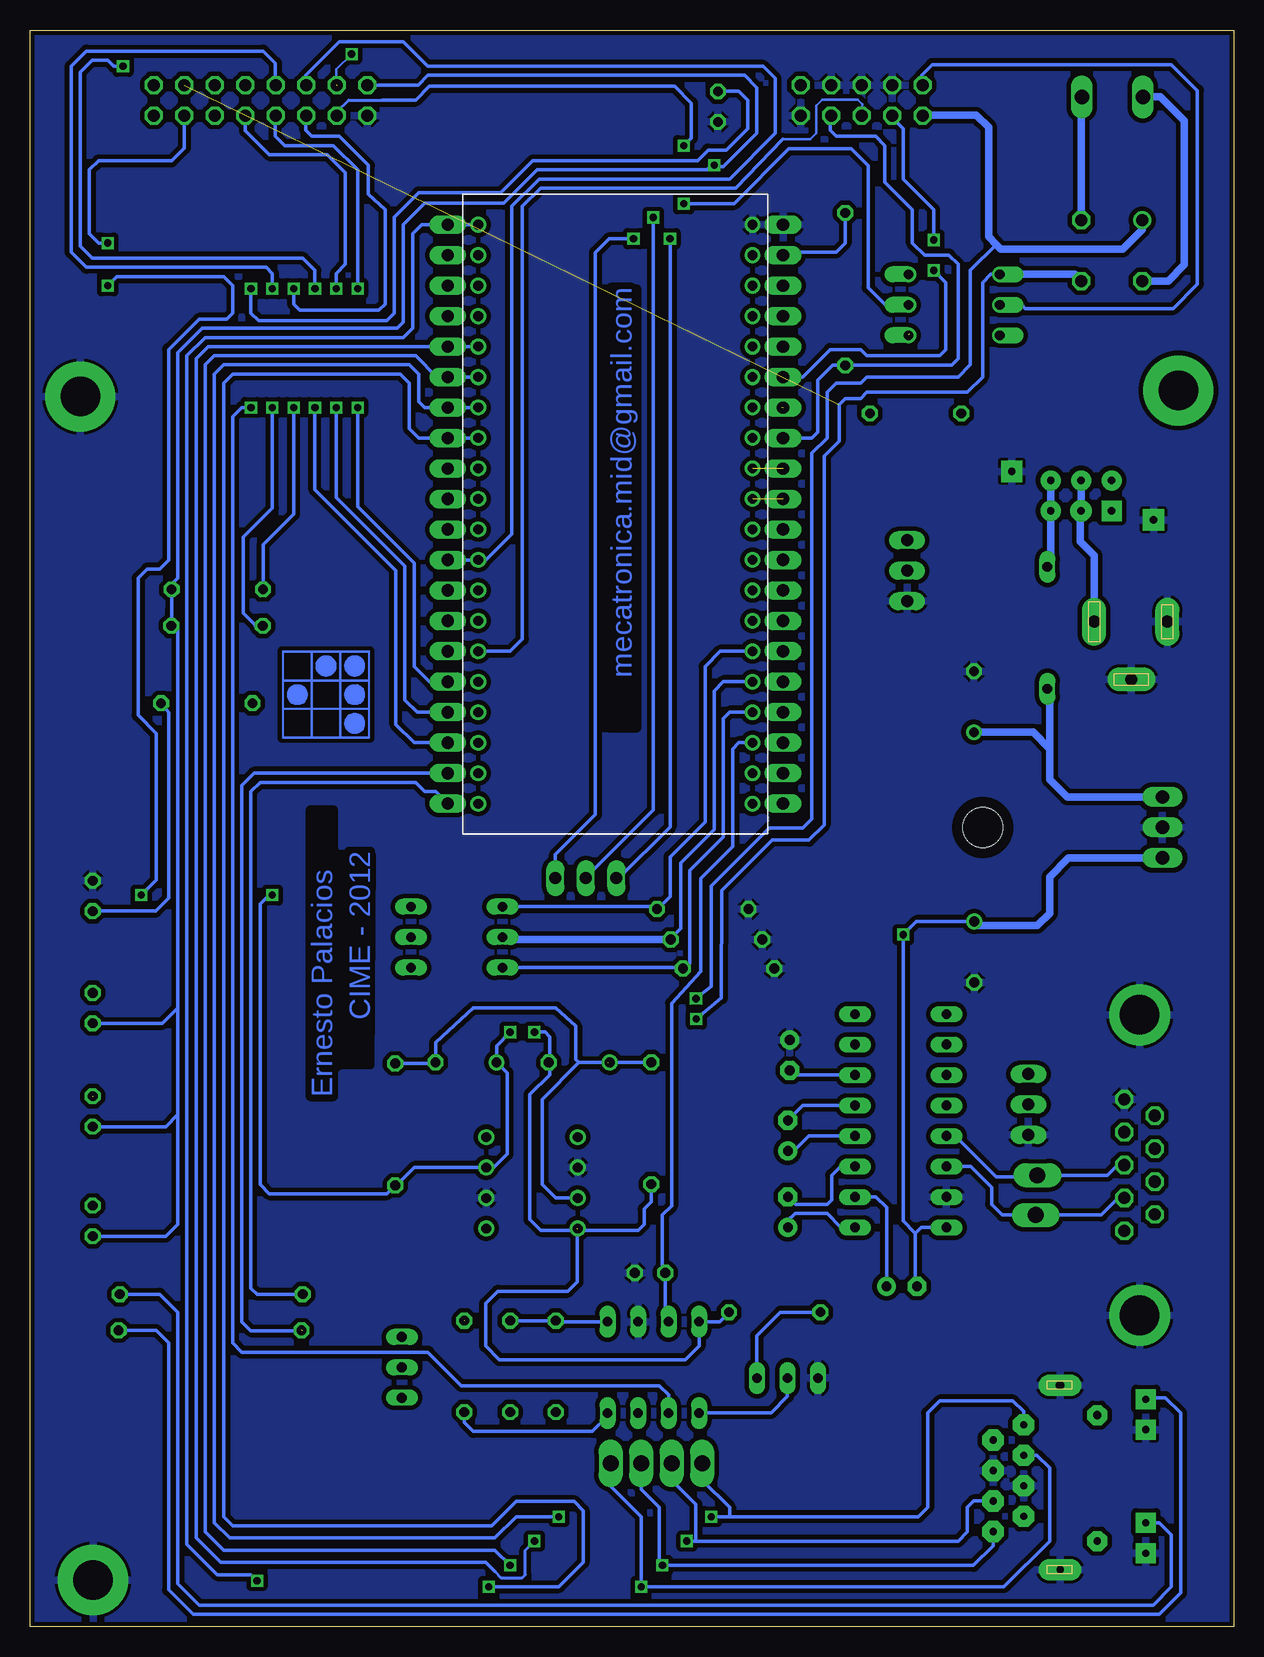
[diagram p7: board, bottom side, seen from below]

Size 100.33 x 133.1 mm. Coordinates in mm from the lower left corner, seen from the top.
Outline: 0,0 100.33,0 100.33,133.1 0,133.1 0,0
Copper layers (1*16): Top 0.035mm / dielectric 1.5mm / Bottom 0.035mm
Design rules: minimum track width 10mil, minimum drill 24mil, track to track 15mil, track to pad 15mil, pad to pad 15mil, via to via 15mil, smd to smd 15mil, copper to edge 15mil, drill to drill 8mil, minimum pad ring 10mil, minimum via ring 8mil, stop-mask expansion 4mil, vias tented up to drill 0mil, thermal gap 10mil
Milling: 8 lines

### Footprints (pad centres in the part's own frame; a part is rotated, then mirrored left to right if it is on the bottom)
DCJ0303 = drill 1 pad 2 long: 1 0,3.1; 2 4.8,0; 3 0,-3
W237-132 = drill 1.194 long: 1 -2.54,-0.635; 2 2.54,-0.635
RB1A = drill 1.016: + -2.54,2.54 | drill 1.016 octagon: - 2.54,-2.54; AC1 2.54,2.54; AC2 -2.54,-2.54
LED3MM = drill 0.813 octagon: A -1.27,0; K 1.27,0
TT5D7 = drill 0.813: + -2.54,0 | drill 0.813 octagon: - 2.54,0
E2,5-6E = drill 0.813 pad 1.575: + -1.27,0 | drill 0.813 pad 1.575 octagon: - 1.27,0
C025-024X044 = drill 0.813 octagon: 1 -1.27,0; 2 1.27,0
057-010-1 = drill 1 octagon: 1 -5.08,-1.27; 2 -5.08,1.27; 3 -2.54,-1.27; 4 -2.54,1.27; 5 0,-1.27; 6 0,1.27; 7 2.54,-1.27; 8 2.54,1.27; 9 5.08,-1.27; 10 5.08,1.27
057-016-1 = drill 1 octagon: 1 -8.89,-1.27; 2 -8.89,1.27; 3 -6.35,-1.27; 4 -6.35,1.27; 5 -3.81,-1.27; 6 -3.81,1.27; 7 -1.27,-1.27; 8 -1.27,1.27; 9 1.27,-1.27; 10 1.27,1.27; 11 3.81,-1.27; 12 3.81,1.27; 13 6.35,-1.27; 14 6.35,1.27; 15 8.89,-1.27; 16 8.89,1.27
DIP03YL = drill 0.813 long: 1 -2.54,-3.81; 2 0,-3.81; 3 2.54,-3.81; 4 2.54,3.81; 5 0,3.81; 6 -2.54,3.81
DO35-10 = drill 0.813 long: A 5.08,0; C -5.08,0
RJ9W = drill 0.813 long: A 2.54,0.635; E -2.54,0.635; S 0,0.635
3,3-PAD = drill 3.3 pad 5.842: B3,3 0,0
DIL16 = drill 0.813 long: 1 -8.89,-3.81; 2 -6.35,-3.81; 3 -3.81,-3.81; 4 -1.27,-3.81; 5 1.27,-3.81; 6 3.81,-3.81; 7 6.35,-3.81; 8 8.89,-3.81; 9 8.89,3.81; 10 6.35,3.81; 11 3.81,3.81; 12 1.27,3.81; 13 -1.27,3.81; 14 -3.81,3.81; 15 -6.35,3.81; 16 -8.89,3.81
TO220H = drill 1.118 long: 1 -2.54,-10.16; 2 0,-10.16; 3 2.54,-10.16 | hole 3.302: 0,4.826
DIL08 = drill 0.813 pad 1.27: 1 -3.81,-3.81; 2 -1.27,-3.81; 3 1.27,-3.81; 4 3.81,-3.81; 5 3.81,3.81; 6 1.27,3.81; 7 -1.27,3.81; 8 -3.81,3.81
DIL08' = drill 0.813 long: 1 -3.81,-3.81; 2 -1.27,-3.81; 3 1.27,-3.81; 4 3.81,-3.81; 5 3.81,3.81; 6 1.27,3.81; 7 -1.27,3.81; 8 -3.81,3.81
1X20 = drill 1.016 long: 1 -24.13,0; 2 -21.59,0; 3 -19.05,0; 4 -16.51,0; 5 -13.97,0; 6 -11.43,0; 7 -8.89,0; 8 -6.35,0; 9 -3.81,0; 10 -1.27,0; 11 1.27,0; 12 3.81,0; 13 6.35,0; 14 8.89,0; 15 11.43,0; 16 13.97,0; 17 16.51,0; 18 19.05,0; 19 21.59,0; 20 24.13,0
MBED-KIT = drill 0.8: D+ 11.43,1.27; D- 11.43,3.81; GND -11.43,24.13; IF+ 11.43,16.51; IF- 11.43,19.05; NR -11.43,16.51; P$5 -11.43,13.97; P$6 -11.43,11.43; P$7 -11.43,8.89; P$8 -11.43,6.35; P$9 -11.43,3.81; P$10 -11.43,1.27; P$11 -11.43,-1.27; P$12 -11.43,-3.81; P$13 -11.43,-6.35; P$14 -11.43,-8.89; P$15 -11.43,-11.43; P$16 -11.43,-13.97; P$17 -11.43,-16.51; P$18 -11.43,-19.05; P$19 -11.43,-21.59; P$20 -11.43,-24.13; P$21 11.43,-24.13; P$22 11.43,-21.59; P$23 11.43,-19.05; P$24 11.43,-16.51; P$25 11.43,-13.97; P$26 11.43,-11.43; P$27 11.43,-8.89; P$28 11.43,-6.35; P$29 11.43,-3.81; P$30 11.43,-1.27; RD+ 11.43,11.43; RD- 11.43,13.97; TD+ 11.43,6.35; TD- 11.43,8.89; VB -11.43,19.05; VIN -11.43,21.59; VOUT 11.43,24.13; VU 11.43,21.59
DIL06 = drill 0.813 offset: 1 -2.54,-3.81; 2 0,-3.81; 3 2.54,-3.81; 4 2.54,3.81; 5 0,3.81; 6 -2.54,3.81
BOTON_ENCNEDIDO = drill 0.6 pad 1.778 square: G1 -2.019,6.039; G2 2.018,-5.785 | drill 0.6 pad 1.676 square: P1 -1.27,2.54 | drill 0.6 pad 1.778: P2 -1.27,0 | drill 0.6 pad 1.676: P3 -1.27,-2.54; P4 1.27,-2.54; P5 1.27,0; P6 1.27,2.54
0204/7 = drill 0.813 octagon: 1 -3.81,0; 2 3.81,0
22-23-2031 = drill 1 long: 1 -2.54,0; 2 0,0; 3 2.54,0
0207/15 = drill 0.813 octagon: 1 -7.62,0; 2 7.62,0
0207/10 = drill 0.813 octagon: 1 -5.08,0; 2 5.08,0
0207/12 = drill 0.813 octagon: 1 -6.35,0; 2 6.35,0
0207/7 = drill 0.813 octagon: 1 -3.81,0; 2 3.81,0
P1-13Y = drill 1.321 pad 1.905 long: TP 0,0
RJ45-GENERIC = drill 0.6 pad 1.778 octagon: P1 12.2,19.685; P2 10.93,17.145; P3 9.66,19.685; P4 8.39,17.145; P5 7.12,19.685; P6 5.85,17.145; P7 4.58,19.685; P8 3.31,17.145 | drill 0.6 pad 1.676 square: PAAMA 1.17,6.958; PAV 11.465,6.958; PKAM 3.71,6.958; PKV 14.005,6.958 | drill 0.6 pad 1.778 long: PSHIEL2 15.375,14.105 | drill 0.7 pad 1.778 long: PSHIELD1 0,14.105 | drill 0.7 pad 1.676 octagon: PSTAND 2.5,11.008 | drill 0.6 pad 1.676 octagon: PSTAND2 13,11.008
F09HP = drill 1.016 octagon: 1 -5.486,-1.27; 2 -2.743,-1.27; 3 0,-1.27; 4 2.743,-1.27; 5 5.486,-1.27; 6 -4.115,1.27; 7 -1.372,1.27; 8 1.372,1.27; 9 4.115,1.27 | drill 3.302 pad 5.08: G1 -12.522,0; G2 12.522,0

### Placement (x,y rotation side)
9VDC  8.56,83.77 270 top
24V  10.13,126.88 180 top
B1  10.18,114.7 0 top
BAUD  95.11,42.95 90 top
C1_9V  21.67,77.1 90 top
C1_+24  63.99,47.04 0 top
C1_MAX  37.17,34.56 90 top
C2_0V  54.56,47.03 0 top
C2_9V  21.63,56.23 270 top
C2_MAX  37.17,40.93 90 top
C3_AOUT  43,126.71 270 top
C3_MAX  37.02,47.64 270 top
C4_MAX  27.68,28.37 180 top
C5_AOUT  48.66,29.49 0 top
CON_DRIVER  31.03,127.23 0 top
CON_ENCODER  81.11,127.23 0 top
CONFIG  64.77,57.48 270 top
D1_INPUT  15.56,83.26 90 top
ETH  95.11,51.57 90 top
GAIN  68.71,21.62 270 top
H1  96.14,102.55 0 top
H2  4.63,103.05 0 top
H3  95.08,3.88 0 top
IC1  27.77,42.17 90 top
IC2  16.12,66.62 270 top
IC3  58.5,37 270 top
IC4  AD620N  [DIL08']  48.39,21.62 180 top
JP_LEFT  37.58,92.74 90 top
JP_RIGHT  65.52,92.74 270 top
KIT1  51.55,92.74 0 top
OFFSET  37.21,21.36 180 top
OK1  23.32,110.18 90 top
ON/OFF  12.74,94.28 90 top
PC  95.11,33.83 90 top
POWER  95.11,60.92 90 top
PWR_LED_R  85.59,76.98 0 top
QED  54,62.4 0 top
R1  85.33,24.7 0 top
R1_DIV  69.9,41.86 90 top
R1_G  60.32,21.7 270 top
R2  85.23,27.71 0 top
R2_DIV  48.55,41.96 270 top
R2_G  64.14,21.7 270 top
R3  84.74,83.44 0 top
R3_G  56.51,21.7 270 top
R4  84.72,86.47 0 top
R13  42.11,54.86 0 top
R14  43.13,57.28 0 top
R15  44.27,59.82 0 top
R16_ALM  32.39,111.49 90 top
R_REF  38.27,26.21 0 top
R_SON  26.53,101.14 180 top
RD+  49.4,13.61 180 top
RD-  46.86,13.61 180 top
RX  16.38,37.62 90 top
TD+  51.94,13.61 180 top
TD-  44.32,13.61 180 top
TTL-IN  17.13,43.53 270 top
TTL-RS232  27.24,88.03 270 top
TX  16.51,34.32 90 top
U$1  0.38,20.13 270 top
X1  7.87,38.48 90 top

### Tracks (layer width: path | path; a pad name or v marks a point on that pad's centre or on a via)
3.3V  (via drill 0.6)
  Top 0.305: U$1.P2 17.49,9.17 16.64,9.17 15.37,10.44 15.37,17.55 17.14,19.33 19.18,19.33 20.07,18.44 U$1.P7 20.1,15.52 21.72,15.52 26.54,10.69 39.24,10.69 48.39,1.55 80.39,1.55 81.41,2.56 v81.41,3.83
  Top 0.61: KIT1.VOUT JP_RIGHT.1
  Bottom 0.305: KIT1.VOUT 67.69,116.86 68.45,116.1 68.45,108.23 69.21,107.47 85.72,107.47 87.25,105.94 87.25,6.88 84.71,4.34 81.91,4.34 v81.41,3.83
24V0  (via drill 0.6)  (2 unrouted)
  Top 0.305: v44.81,50.65 57.2,50.65 v58.29,49.55
  Bottom 0.305: OK1.4 20.27,112.72 20.95,112.04 20.95,104.16 22.22,102.89 30.61,102.89 31.11,102.39 32.38,102.39 32.89,101.88 32.89,98.83 34.16,97.56 34.16,66.83 35.43,65.56 38.48,65.56 42.67,61.37 42.72,52.39 v44.81,50.65 | v58.29,49.55 57.4,49.55 57.02,49.17 57.02,47.11 C2_0V.- 57.02,46.95 57.02,46 58.67,44.35 58.67,33.93 57.78,33.05 54.86,33.05 54.74,33.17 | R2_DIV.2 48.55,35.42 49.15,34.82 49.15,33.55 49.66,33.05 54.54,33.05 IC3.4 54.74,33.14 54.74,28.73 55.5,27.97 61.34,27.97 62.36,26.95 62.36,23.39 61.21,22.25 45.72,22.25 44.58,23.39 IC4.4 42.87,25.43 R_REF.2
  Bottom 0.61: OK1.4 13.28,112.72 B1.-
24V1  (via drill 0.6)
  Top 0.305: v93.85,115.34 v93.85,111.78 | v91.06,60.99 v80.14,60.99 | IC4.7 49.66,19.33 50.16,19.84 53.47,19.84 54.23,20.6 54.23,26.7 55.24,27.71 59.56,27.71 60.32,28.47 60.32,37.62 61.09,38.38 62.2,38.38 IC3.7 | v44.83,52.35 45.57,52.35 46.35,51.56 58.32,51.56 v60.32,49.55
  Bottom 0.305: v60.32,49.55 61.45,48.43 C1_+24.+ 60.58,46.16 60.58,39.4 61.7,38.27 IC3.7 68.31,38.27 69.85,36.73 69.85,36.74 R1_DIV.1 70.59,36.09 80.39,36.09 81.15,36.86 81.15,60.22 80.39,60.99 v80.14,60.99 | v44.83,52.35 43.56,53.37 43.56,61.75 38.73,66.57 35.94,66.57 35.18,67.33 35.18,97.81 33.91,99.08 33.91,102.89 33.15,103.66 31.11,103.66 30.61,104.16 22.99,104.16 21.97,105.18 21.97,113.05 19.81,115.21 | CON_ENCODER.13 87.46,123.26 88.52,122.2 94.61,122.2 95.38,121.44 95.38,116.1 94.61,115.34 v93.85,115.34 | v93.85,111.78 93.09,112.55 84.2,112.55 83.44,111.78 83.44,109.5 83.95,108.99 86.23,108.99 88.77,106.45 88.77,88.92 89.53,88.16 90.55,88.16 91.31,87.4 91.31,75.97 89.79,74.45 89.79,62.26 v91.06,60.99
  Bottom 0.61: B1.+ 7.64,116.46 9.27,114.83 19.43,114.83 19.81,115.21 20.45,115.85 20.45,124.99 21.46,126.01 25.89,126.01 CON_DRIVER.1
ALM
  Top 0.61: KIT1.P$8 JP_LEFT.13
  Bottom 0.305: JP_LEFT.13 35.18,99.08 34.67,99.59 34.67,103.91 33.44,105.14 R16_ALM.1 23.53,105.14 22.99,105.69 22.99,113.56 23.75,114.33 25.78,114.33 26.8,115.34 26.8,118.14 29.08,120.42 29.08,123.47 29.84,124.23 33.15,124.23 33.65,124.74 33.65,125.87 CON_DRIVER.7
CONFIG0
  Top 0.61: KIT1.P$15 JP_LEFT.6
  Bottom 0.305: KIT1.P$15 42.8,81.3 44.07,80.03 44.07,67.08 46.99,64.16 46.99,60.86 48.03,59.82 R15.2 48.51,60.02 CONFIG.1
CONFIG1
  Top 0.61: KIT1.P$16 JP_LEFT.5
  Bottom 0.305: R14.2 46.89,57.4 46.1,58.19 46.1,63.65 43.31,66.45 43.31,78 42.54,78.77 KIT1.P$16
  Bottom 0.61: R14.2 60.76,57.27 CONFIG.2
CONFIG2
  Top 0.61: KIT1.P$17 JP_LEFT.4
  Bottom 0.305: KIT1.P$17 42.04,76.22 42.54,75.72 42.54,65.81 45.34,63.02 45.34,55.27 45.75,54.86 R13.2 46.75,54.94 CONFIG.3
ENC4  (via drill 0.6)  (1 unrouted)
  Top 0.305: v76.58,101.62 v76.58,111.53 | v92.58,130.07 92.33,130.33 74.29,130.33 v73.53,131.09
  Top 0.61: KIT1.P$23 JP_RIGHT.18
  Bottom 0.203: v73.53,131.09 74.8,129.82 74.8,128.55
  Bottom 0.305: JP_RIGHT.18 68.33,73.69 69.85,75.21 69.85,88.04 76.58,94.77 v76.58,101.62 | v76.58,111.53 76.58,113.05 77.6,114.07 95.12,114.07 96.14,115.09 96.14,129.56 95.12,130.58 93.85,130.58 93.34,130.07 v92.58,130.07
ENC6
  Top 0.61: KIT1.P$29 JP_RIGHT.12
  Bottom 0.305: JP_RIGHT.12 62.36,88.92 60.2,91.08 60.2,118.39 57.91,120.67 42.04,120.67 38.23,124.48 38.23,129.06 39.24,130.07 67.18,130.07 69.21,132.11 74.55,132.11 77.34,129.31 77.34,128.55 CON_ENCODER.6
ENC7  (via drill 0.6)
  Top 0.305: v73.02,101.62 v73.02,111.53
  Top 0.61: KIT1.P$25 JP_RIGHT.16
  Bottom 0.305: JP_RIGHT.16 67.06,78.77 68.33,80.03 68.33,88.67 73.02,93.37 v73.02,101.62 | v73.02,111.53 73.02,121.44 75.06,123.47 79.12,123.47 79.88,124.23 79.88,125.92 CON_ENCODER.7
ENC9  (via drill 0.6)
  Top 0.305: v74.8,101.62 v74.8,111.53
  Top 0.61: KIT1.P$24 JP_RIGHT.17
  Bottom 0.305: JP_RIGHT.17 68.07,76.22 69.09,77.24 69.09,88.42 74.8,94.13 v74.8,101.62 | v74.8,111.53 74.8,112.8 74.04,113.56 74.04,121.18 75.56,122.71 80.39,122.71 82.38,124.7 CON_ENCODER.9
ETH_LED_AMARILLO  (1 unrouted)
  Top 0.61: KIT1.P$22 JP_RIGHT.19
  Bottom 0.305: JP_RIGHT.19 81.66,71.14 82.68,70.13 82.68,25.43 81.91,24.66 77.6,24.66
ETH_LED_VERDE
  Top 0.61: KIT1.P$21 JP_RIGHT.20
  Bottom 0.305: R2.1 81.41,27.71 81.91,28.22 81.91,69.62 81.15,70.38 68.2,70.38 67.44,69.62 66.53,69.62 JP_RIGHT.20
GND
  pour Bottom (rank 3): 0.13,21.42 0.13,133.04 100.1,132.97 100.11,132.96 100.09,0.01 0.18,0.16
  pour Top: 0.13,0.03 100.2,0.03 100.2,133.12 0.13,133.12
INDEX  (via drill 0.6 pad 1.02)
  Top 0.305: CON_ENCODER.16 91.21,128.5 91.95,127.76 91.95,124.97 89.28,122.3 55.75,122.3 50.04,116.59 v50.04,115.7
  Bottom 0.305: QED.3 56.54,64.36 53.21,67.69 53.21,114.55 52.07,115.7 v50.04,115.7
MAX_R1
  Top 0.305: TTL-IN.2 23.88,43.53 IC1.12
MAX_RX
  Bottom 0.305: IC1.13 23.22,40.9 19.81,37.49 16.51,37.49 | X1.3 9.68,38.48 10.54,37.62 RX.TP
  Bottom 0.61: 16.51,37.49 RX.TP
MAX_T1
  Top 0.305: TTL-IN.1 23.88,46.07 IC1.11
MAX_TX
  Bottom 0.305: IC1.14 21.95,38.36 20.19,36.6 20.19,35.2 19.3,34.32 TX.TP 11.05,34.32 9.63,35.73 X1.2
MBED_RX
  Top 0.406: JP_LEFT.7 35.8,83.84 30.73,89.04 28.89,89.04 27.9,88.05 27.27,88.05 TTL-RS232.2
  Top 0.61: KIT1.P$14 JP_LEFT.7
MBED_TX
  Top 0.406: JP_LEFT.8 34.56,86.38 30.4,90.55 27.25,90.55 TTL-RS232.1
  Top 0.61: KIT1.P$13 JP_LEFT.8
MBED_VOUT
  Top 0.61: KIT1.P$18 JP_LEFT.3
  Bottom 0.305: KIT1.P$18 41.27,73.69 41.78,73.18 41.78,65.05 44.45,62.38 44.45,54.63 46.86,51.97 46.86,35.08 47.62,34.32 47.62,29.73 C5_AOUT.1 47.39,25.7 IC4.3
N$1
  Bottom 0.61: B1.AC1 12.72,127.46 24V.1
N$2
  Bottom 0.61: B1.AC2 5.49,112.16 4.13,113.52 4.13,125.52 6.13,127.52 7.58,127.52 24V.2
N$3  (1 unrouted)
  Bottom 0.305: R1_DIV.2 66.5,46.94 C1_+24.- 66.53,48.68 63.37,51.59 56.51,51.59 54.86,50.06 54.86,47.27 54.61,47.02 | 52.2,47.2 C2_0V.+ 52.16,47.04 R2_DIV.1 | IC3.3 56.53,35.73 57.66,36.86 57.66,43.97 54.61,47.02 | 54.61,47.02 52.2,47.02 52.07,47.14
N$4  (1 unrouted)
N$5
  Top 0.61: KIT1.VU JP_RIGHT.2
N$6  (1 unrouted)
N$7
  Top 0.61: KIT1.IF- JP_RIGHT.3
N$8
  Bottom 0.305: R_REF.1 37.79,26.21 39.78,24.23 39.78,20.75 OFFSET.E
N$9
  Bottom 0.305: IC4.1 56.43,25.43 R3_G.1 R1_G.1
N$10  (1 unrouted)
  Top 0.305: R3_G.2 R1_G.2 61.42,17.89 62.1,18.57 62.1,24.79 62.86,25.55 64.13,25.55
  Top 0.406: GAIN.E 68.83,24.16 67.44,25.55 64.13,25.55
N$11
  Top 0.406: R2_G.2 68.15,17.89 GAIN.A GAIN.S
  Bottom 0.305: IC4.8 52.2,17.55 53.47,16.28 63.37,16.28 64.13,17.04 R2_G.2
N$12
  Bottom 0.61: D1_INPUT.A 15.28,88.62 ON/OFF.P3 ON/OFF.P4
N$14
  Top 0.61: KIT1.IF+ JP_RIGHT.4
N$15
  Bottom 0.305: OFFSET.S 37.21,19.19 38.58,17.83 44.56,17.83 IC4.5
N$16
  Top 0.61: KIT1.P$30 JP_RIGHT.11
N$17
  pour Top: 73.3,110.65 74.5,110.65 74.5,102.45 73.3,102.45
N$18
  Bottom 0.61: 9VDC.1 11.66,89.28 12.83,90.45 12.83,92.92 ON/OFF.P2 ON/OFF.P5
N$19
  pour Top: 75,110.85 76.3,110.85 76.3,102.35 75.1,102.35 75.1,110.75
N$20  (1 unrouted)
  Top 0.305: R_SON.2 22.72,104.66 23.75,105.69 26.29,105.69 27.05,106.45 27.05,107.72 27.3,107.97
N$21
  Bottom 0.61: IC2.1 13.89,69.16 15.37,70.64 15.37,73.18 | 15.37,73.18 15.37,77.99 D1_INPUT.C | C1_9V.+ 16.74,74.55 15.37,73.18
N$22
  pour Top: 76.9,110.85 78,110.85 78,102.45 76.9,102.45
N$23
  pour Top: 78.6,110.85 79.8,110.85 79.8,102.35 78.7,102.35 78.7,110.75
N$24
  Top 0.305: CONFIG.6 68.91,60.02 70.74,58.19 86.23,58.19 91.57,52.86 95.08,52.86 ETH.K
N$25  (1 unrouted)
  Top 0.305: CONFIG.5 85.93,57.48 91.82,51.59 91.82,47.52 95.12,44.22
N$26
  Top 0.305: CONFIG.4 69.01,54.94 70.74,56.67 85.47,56.67 91.06,51.08 91.06,39.14 PC.K
N$27
  pour Top: 80.5,110.85 81.6,110.85 81.6,102.45 80.5,102.45
N$28
  cutout Bottom: 71.88,73.91 71.88,81.09 arc-90 72.2,81.41 79.38,81.41 79.38,74.23 arc-90 79.06,73.91
N$29
  cutout Bottom (isolate 0.406): 75.06,43.82 76.96,43.82 arc90 77.34,44.2 77.34,68.05 arc90 76.94,68.45 75.08,68.45 arc90 74.68,68.05 74.67,64.96 arc-90 74.35,64.64 71.88,64.64 arc93 71.5,64.26 71.63,46.86 arc90 72.01,46.48 74.29,46.48 arc-90 74.68,46.1 74.68,44.2 arc90
N$30
  cutout Top: 72.39,31.62 72.39,33.53 arc-90 72.64,33.78 77.72,33.78 85.47,33.78 88.9,33.78 89.03,33.78 arc-90 89.15,33.66 89.15,31.62 arc-90 89.03,31.5 80.52,31.5 72.64,31.5 72.52,31.5 arc-90
N$31
  Top 0.61: KIT1.D- JP_RIGHT.9
N$32
  Top 0.61: KIT1.D+ JP_RIGHT.10
N$33
  Bottom 0.305: IC1.1 32.75,33.28 33.91,34.44 36.58,34.44 37.21,33.81 37.16,33.28 C1_MAX.+
N$34
  Bottom 0.305: IC1.3 32.78,38.36 33.53,37.62 33.53,35.59 33.91,35.2 34.81,35.19 36.53,35.19 C1_MAX.-
N$35
  Bottom 0.305: IC1.5 35.92,43.44 C2_MAX.-
N$36
  Bottom 0.305: C2_MAX.+ 36.69,39.66 35.43,40.92 31.6,40.92 IC1.4
N$37
  Bottom 0.305: C4_MAX.+ 28.95,34.95 29.84,35.84 31.57,35.84 IC1.2
N$38
  Bottom 0.305: IC1.6 36.63,45.98 C3_MAX.-
N$39
  cutout Top: 72.77,16.26 72.77,20.19 arc-90 73.28,20.83 89.15,20.83 arc-90 89.92,19.81 89.92,18.41 arc90 90.3,17.91 92.46,17.91 arc-90 92.84,17.53 92.84,16.13 arc-90 92.46,15.75 73.15,15.75 arc-90
N$40
  cutout Bottom: 49.78,74.55 52.07,74.55 arc90 52.45,74.93 52.45,111.51 arc90 52.07,111.89 49.8,111.89 arc90 49.4,111.49 49.4,74.93 arc90
N$41
  cutout Top: 3.05,74.3 10.79,74.3 arc90 11.43,75.06 11.43,76.33 arc90 10.79,76.96 3.05,76.96 arc90 2.54,76.45 2.54,74.8 arc90
N$42
  cutout Top: 43.56,92.2 43.56,93.73 arc-90 43.94,94.11 44.07,94.11 49.91,94.11 54.86,94.11 59.69,94.11 60.32,94.11 arc-90 60.83,93.6 60.83,90.93 arc-90 60.32,90.42 60.07,90.42 55.88,90.42 arc90 55.5,90.04 55.5,88.52 arc-90 54.99,88.01 54.61,88.01 48.26,88.01 47.75,88.01 arc-90 47.24,88.52 47.24,88.65 47.24,90.04 arc90 46.86,90.42 46.1,90.42 44.2,90.42 arc-90 43.56,91.06 43.56,91.95
N$43
  cutout Top: 1.65,123.19 1.65,127.64 1.65,131.45 arc-90 2.29,132.08 2.54,132.08 3.68,132.08 arc-90 4.57,131.19 4.57,130.68 4.57,127.89 4.57,122.94 4.57,122.55 4.57,122.05 4.57,121.92 arc-90 3.94,121.28 3.81,121.28 2.41,121.28 arc-90 1.65,122.05 1.65,123.06
N$46
  Bottom 0.305: R1.2 89.82,24.7 88.77,23.65 88.77,3.07 86.74,1.04 6.22,1.04 4.44,2.82 4.44,17.8 5.71,19.08 7.22,19.08 U$1.PAAMA
N$48
  Top 0.61: KIT1.VB JP_LEFT.18
N$49
  Top 0.61: KIT1.NR JP_LEFT.17
N$50
  Top 0.61: KIT1.P$5 JP_LEFT.16
N$52
  Bottom 0.305: R2.2 89.53,27.71 88.01,26.19 88.01,3.58 86.23,1.8 6.73,1.8 5.21,3.33 5.21,7.65 6.22,8.66 U$1.PAV
N$53
  Top 0.61: KIT1.P$11 JP_LEFT.10
N$54
  Top 0.61: KIT1.P$12 JP_LEFT.9
N$59
  Top 0.61: KIT1.P$19 JP_LEFT.2
N$60
  Top 0.61: KIT1.P$20 JP_LEFT.1
N$61
  Bottom 0.305: POWER.A 89.86,59.65 88.77,60.73 88.77,76.22 PWR_LED_R.2
PH_A  (via drill 0.6 pad 1.02)
  Top 0.254: CON_ENCODER.15 90.02,125.96
  Top 0.305: 90.02,125.96 86.99,122.94 53.85,122.94 v48.39,117.48
  Bottom 0.305: v48.39,117.48 48.39,68.07 54,62.46 QED.2
PH_B  (via drill 0.6 pad 1.02)
  Top 0.254: CON_ENCODER.12 84.81,128.5 83.69,127.38 83.69,124.46
  Top 0.305: 83.69,124.46 82.8,123.57 52.58,123.57 46.99,117.98 v46.99,115.7
  Bottom 0.305: v46.99,115.7 46.99,66.67 51.27,62.4 QED.1
PULS+  (via drill 0.6)
  Top 0.305: v25.02,113.05 v25.02,115.59
  Top 0.61: JP_LEFT.15 KIT1.P$6
  Bottom 0.305: JP_LEFT.15 35.94,104.16 33.65,106.45 31.11,106.45 30.61,105.94 24.51,105.94 24,106.45 24,112.04 v25.02,113.05 | v25.02,115.59 25.02,118.14 27.56,120.67 27.56,124.85 28.57,125.87 CON_DRIVER.3
RD+  (via drill 0.6)
  Top 0.305: v47.62,5.11 v60.32,5.11
  Top 0.61: KIT1.RD+ JP_RIGHT.6
  Bottom 0.305: U$1.P1 20.07,6.76 21.72,5.11 v47.62,5.11 47.88,5.36 47.88,9.93 49.4,11.46 RD+.TP | KIT1.RD+ 66.42,104.16 68.2,105.94 84.96,105.94 85.72,105.18 85.72,7.9 84.2,6.38 61.59,6.38 v60.32,5.11
RD-  (via drill 0.6)
  Top 0.305: v45.59,7.14 v58.29,7.14
  Top 0.61: KIT1.RD- JP_RIGHT.5
  Bottom 0.254: 61.59,4.6 61.09,4.09 59.31,4.09 59.05,4.34 59.05,6.38 v58.29,7.14
  Bottom 0.305: U$1.P3 21.68,10.47 22.22,9.93 22.22,7.9 22.99,7.14 44.83,7.14 | 44.83,7.14 v45.59,7.14 | RD-.TP 46.86,12.22 44.83,10.19 44.83,7.14 | KIT1.RD- 85.47,106.7 86.49,105.69 86.49,7.39 84.45,5.36 62.36,5.36 61.59,4.6
SCL  (via drill 0.6)
  Top 0.305: R3.1 80.76,83.44 80.5,83.7 65.67,83.69 JP_RIGHT.14 | v80.14,101.62 v80.14,111.53
  Top 0.61: KIT1.P$27 JP_RIGHT.14
  Bottom 0.305: v80.14,111.53 80.14,112.8 80.64,113.31 95.63,113.31 96.9,114.58 96.9,130.07 95.63,131.34 80.9,131.34 79.88,130.33 79.88,128.55 CON_ENCODER.8 | v80.14,101.62 80.14,93.24 82.55,90.83 82.55,84.48 81.5,83.44
  Bottom 0.406: R3.1 81.5,83.44
SDA  (via drill 0.6)
  Top 0.305: R4.1 65.6,86.46 JP_RIGHT.13 | v78.36,101.62 v78.36,111.53
  Top 0.61: KIT1.P$28 JP_RIGHT.13
  Bottom 0.305: v78.36,111.53 78.36,110.26 77.85,109.75 71.25,109.75 70.74,110.26 70.74,118.14 72.14,119.4 72.14,121.82 74.55,124.23 76.83,124.23 77.34,124.74 77.34,125.92 CON_ENCODER.5 | R4.1 80.91,90.18 78.36,92.73 v78.36,101.62
SERVO_ON  (1 unrouted)
  Top 0.61: R_SON.1 30.35,101.12 34.92,101.12 35.45,101.65 37.7,101.65 37.72,101.62 | KIT1.P$7 JP_LEFT.14
SIGN+
  Top 0.61: KIT1.P$26 JP_RIGHT.15
  Bottom 0.203: 37.59,123.98 35.31,123.98 34.8,124.48 34.8,126.77 34.29,127.28 31.37,127.28 30.99,126.9 30.99,125.99 CON_DRIVER.5
  Bottom 0.305: KIT1.P$26 60.32,81.3 59.31,82.32 59.31,118.39 57.78,119.91 41.53,119.91 37.59,123.98
SON
  Bottom 0.305: OK1.5 17.7,110.18 17.4,109.88 5.08,109.88 3.05,111.91 3.05,128.04 5.21,130.2 25.15,130.2 26.03,129.31 26.03,128.58 CON_DRIVER.2
SON_ON  (via drill 0.6 pad 1.02)
  Top 0.305: v45.85,123.44 v45.85,118.62
  Bottom 0.254: CON_ENCODER.3 74.76,126.28 73.79,127.25 70.99,127.25
  Bottom 0.305: 70.99,127.25 68.2,127.25 67.06,128.4 46.61,128.4 45.21,127 45.21,124.08 v45.85,123.44 | v45.85,118.62 41.66,118.62 37.08,123.19 31.88,123.19 30.48,121.79 30.48,111.63 29.08,110.24 27.19,110.24 OK1.2
TD+  (via drill 0.6)
  Top 0.305: v49.4,3.33 v62.1,3.33
  Top 0.61: KIT1.TD+ JP_RIGHT.8
  Bottom 0.305: U$1.P6 16.41,14.28 15.37,13.23 15.37,7.14 19.18,3.33 v49.4,3.33 49.4,9.17 52.07,11.84 TD+.TP | KIT1.TD+ 67.94,99.08 68.71,99.85 68.71,103.66 69.47,104.42 83.44,104.42 84.2,103.66 84.2,9.17 83.44,8.41 61.85,8.41 59.82,10.44 54.99,10.44 54.23,9.68 54.23,5.36 56.26,3.33 v62.1,3.33
TD-  (via drill 0.6)
  Top 0.305: v43.56,9.17 v56.26,9.17
  Top 0.61: KIT1.TD- JP_RIGHT.7
  Bottom 0.305: U$1.P8 17.53,17.93 18.41,18.82 24.51,18.82 25.53,17.8 25.53,9.93 26.29,9.17 42.04,9.17 | 42.04,9.17 v43.56,9.17 | TD-.TP 44.32,12.22 42.04,9.93 42.04,9.17 | KIT1.TD- 67.44,101.62 67.94,102.13 67.94,104.42 68.71,105.18 84.2,105.18 84.96,104.42 84.96,8.66 83.69,7.39 61.59,7.39 59.82,9.17 v56.26,9.17
VCC  (via drill 0.6)
  Top 0.305: KIT1.VIN 41.02,114.33 41.78,115.09 41.78,120.42 v43.31,121.82 | R3.2 88.77,83.69 88.01,82.93 88.01,79.53 87.25,78.77 83.01,78.77 81.83,77.62 PWR_LED_R.1 81.76,76.9
  Top 0.406: v27.56,57.68 27.56,63.5 29.08,65.02 80.39,65.02 81.79,66.42 81.79,76.07 81.76,76.1 81.76,76.9
  Top 0.61: KIT1.VIN JP_LEFT.19
  Bottom 0.305: R16_ALM.2 32.39,115.33 33.15,114.58 37.32,114.58 JP_LEFT.19 | IC1.16 26.05,33.28 26.54,32.79 | 26.54,32.79 26.54,28.5 C4_MAX.- | C2_9V.+ 26.47,58.77 v27.56,57.68 27.56,33.81 26.54,32.79 | 88.01,51.59 88.01,83.08 88.62,83.69 R3.2 88.53,84.81 R4.2 88.48,86.38 88.77,86.64 88.01,87.4 88.01,106.2 85.98,108.23 69.72,108.23 69.21,108.74 69.21,116.86 67.44,118.64 60.83,118.64 58.04,121.44 43.94,121.44 v43.31,121.82 42.93,121.69 42.54,121.69 39.75,124.48 39.75,128.3 40.77,129.31 67.18,129.31 67.99,128.5 CON_ENCODER.2 | 88.01,51.59 88.01,42.7 | 88.01,42.7 88.01,33.55 89.03,32.54 95.09,32.54 PC.A | BAUD.A 89.03,41.68 88.01,42.7 | ETH.A 89.3,50.3 88.01,51.59
  Bottom 0.61: IC2.3 13.79,64.08 15.37,62.51 15.37,59.46 16.38,58.45 21.31,58.45 C2_9V.+
VCMD  (via drill 0.6)
  Top 0.305: v81.91,101.62 v81.91,111.53 | CON_DRIVER.10 42.48,128.5 C3_AOUT.1
  Bottom 0.305: IC4.6 47.12,19.33 47.88,20.09 64.39,20.09 67.18,22.89 82.68,22.89 83.44,23.65 83.44,100.86 82.68,101.62 v81.91,101.62 | v81.91,111.53 81.91,109.5 81.28,108.86 70.61,108.86 69.98,109.5 69.98,117.5 67.94,119.53 61.09,119.53 58.42,122.2 44.7,122.2 43.81,123.09 42.29,123.09 40.51,124.87 40.51,127.23 41.27,127.99 42.99,127.99 C3_AOUT.1
(copper drawn outside any net)
  shapes: Bottom area x943, Top area x9224

### Text on the board
Top: 24 VDC | Powered by | mbed | 9 VDC | Mecatrónica | Diseñado por: | Ernesto Palacios
Bottom: mecatronica.mid@gmail.com | CIME - 2012 | Ernesto Palacios
tNames: ETH | BAUD | PC